# EAGLE schematic baseboard (EAGLE 9.6.2)
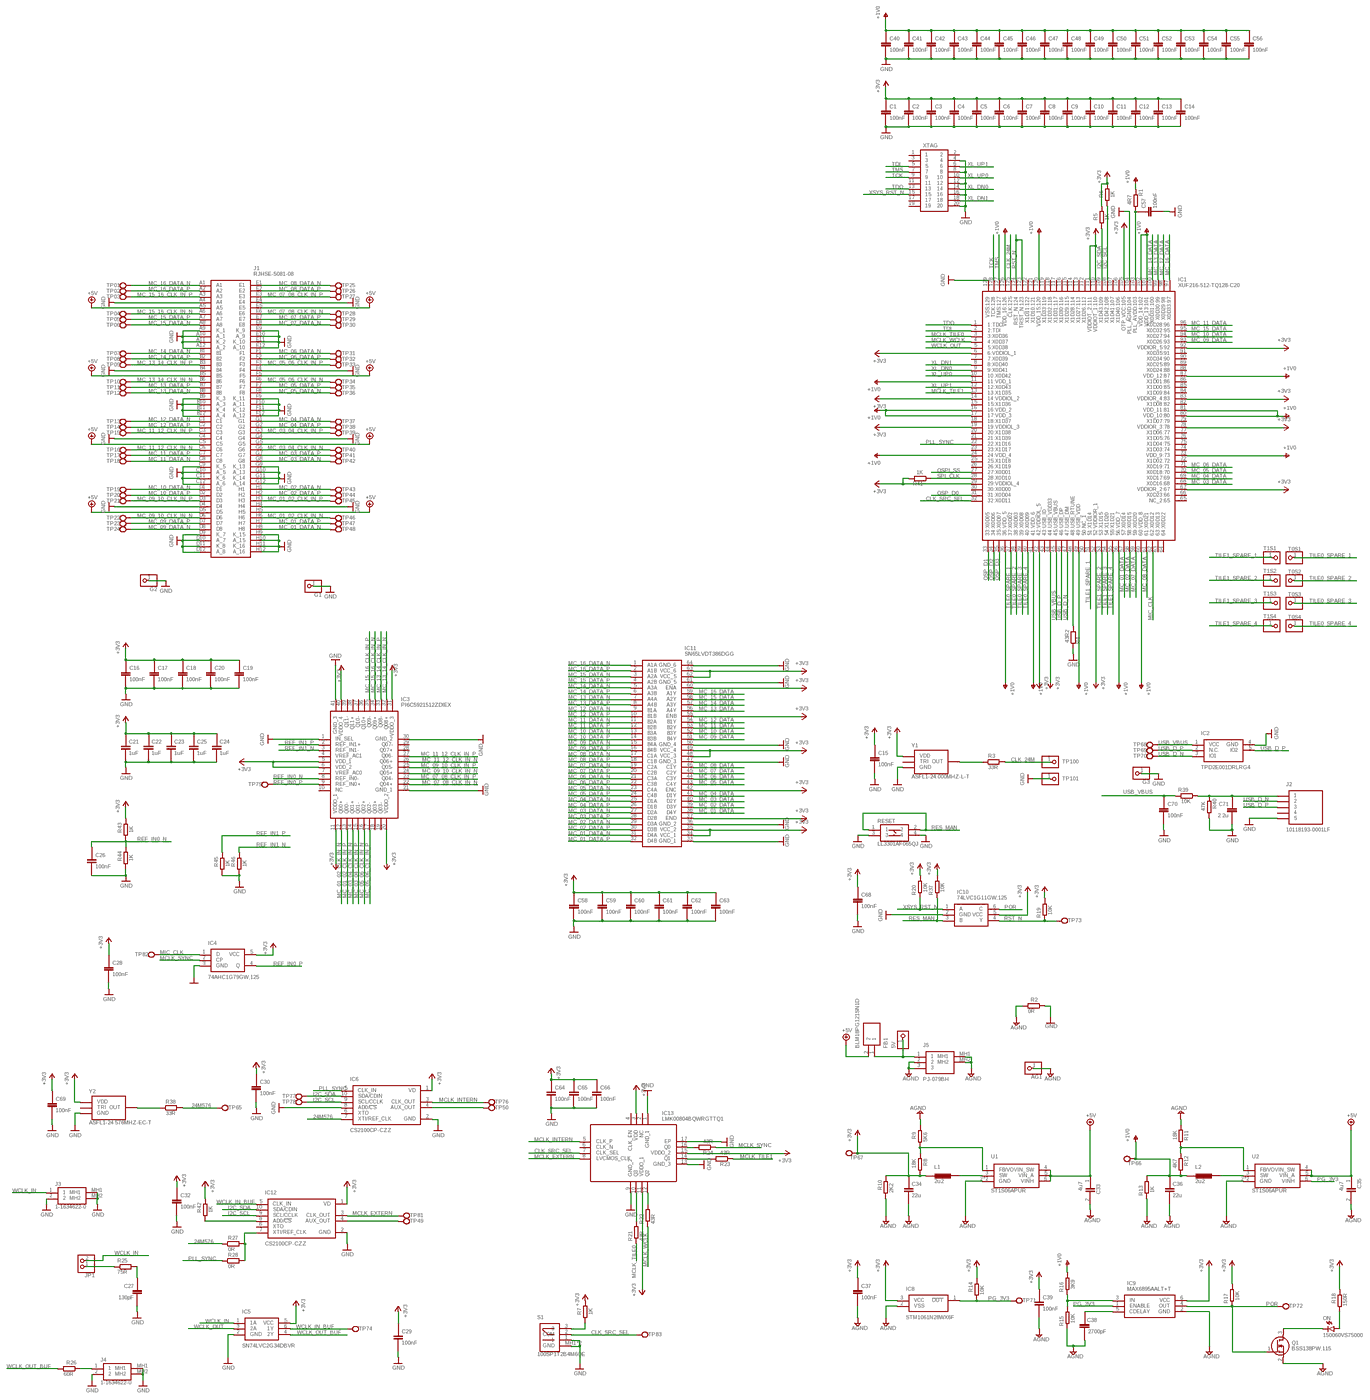
[diagram p0: schematic, sheet 1, overview]
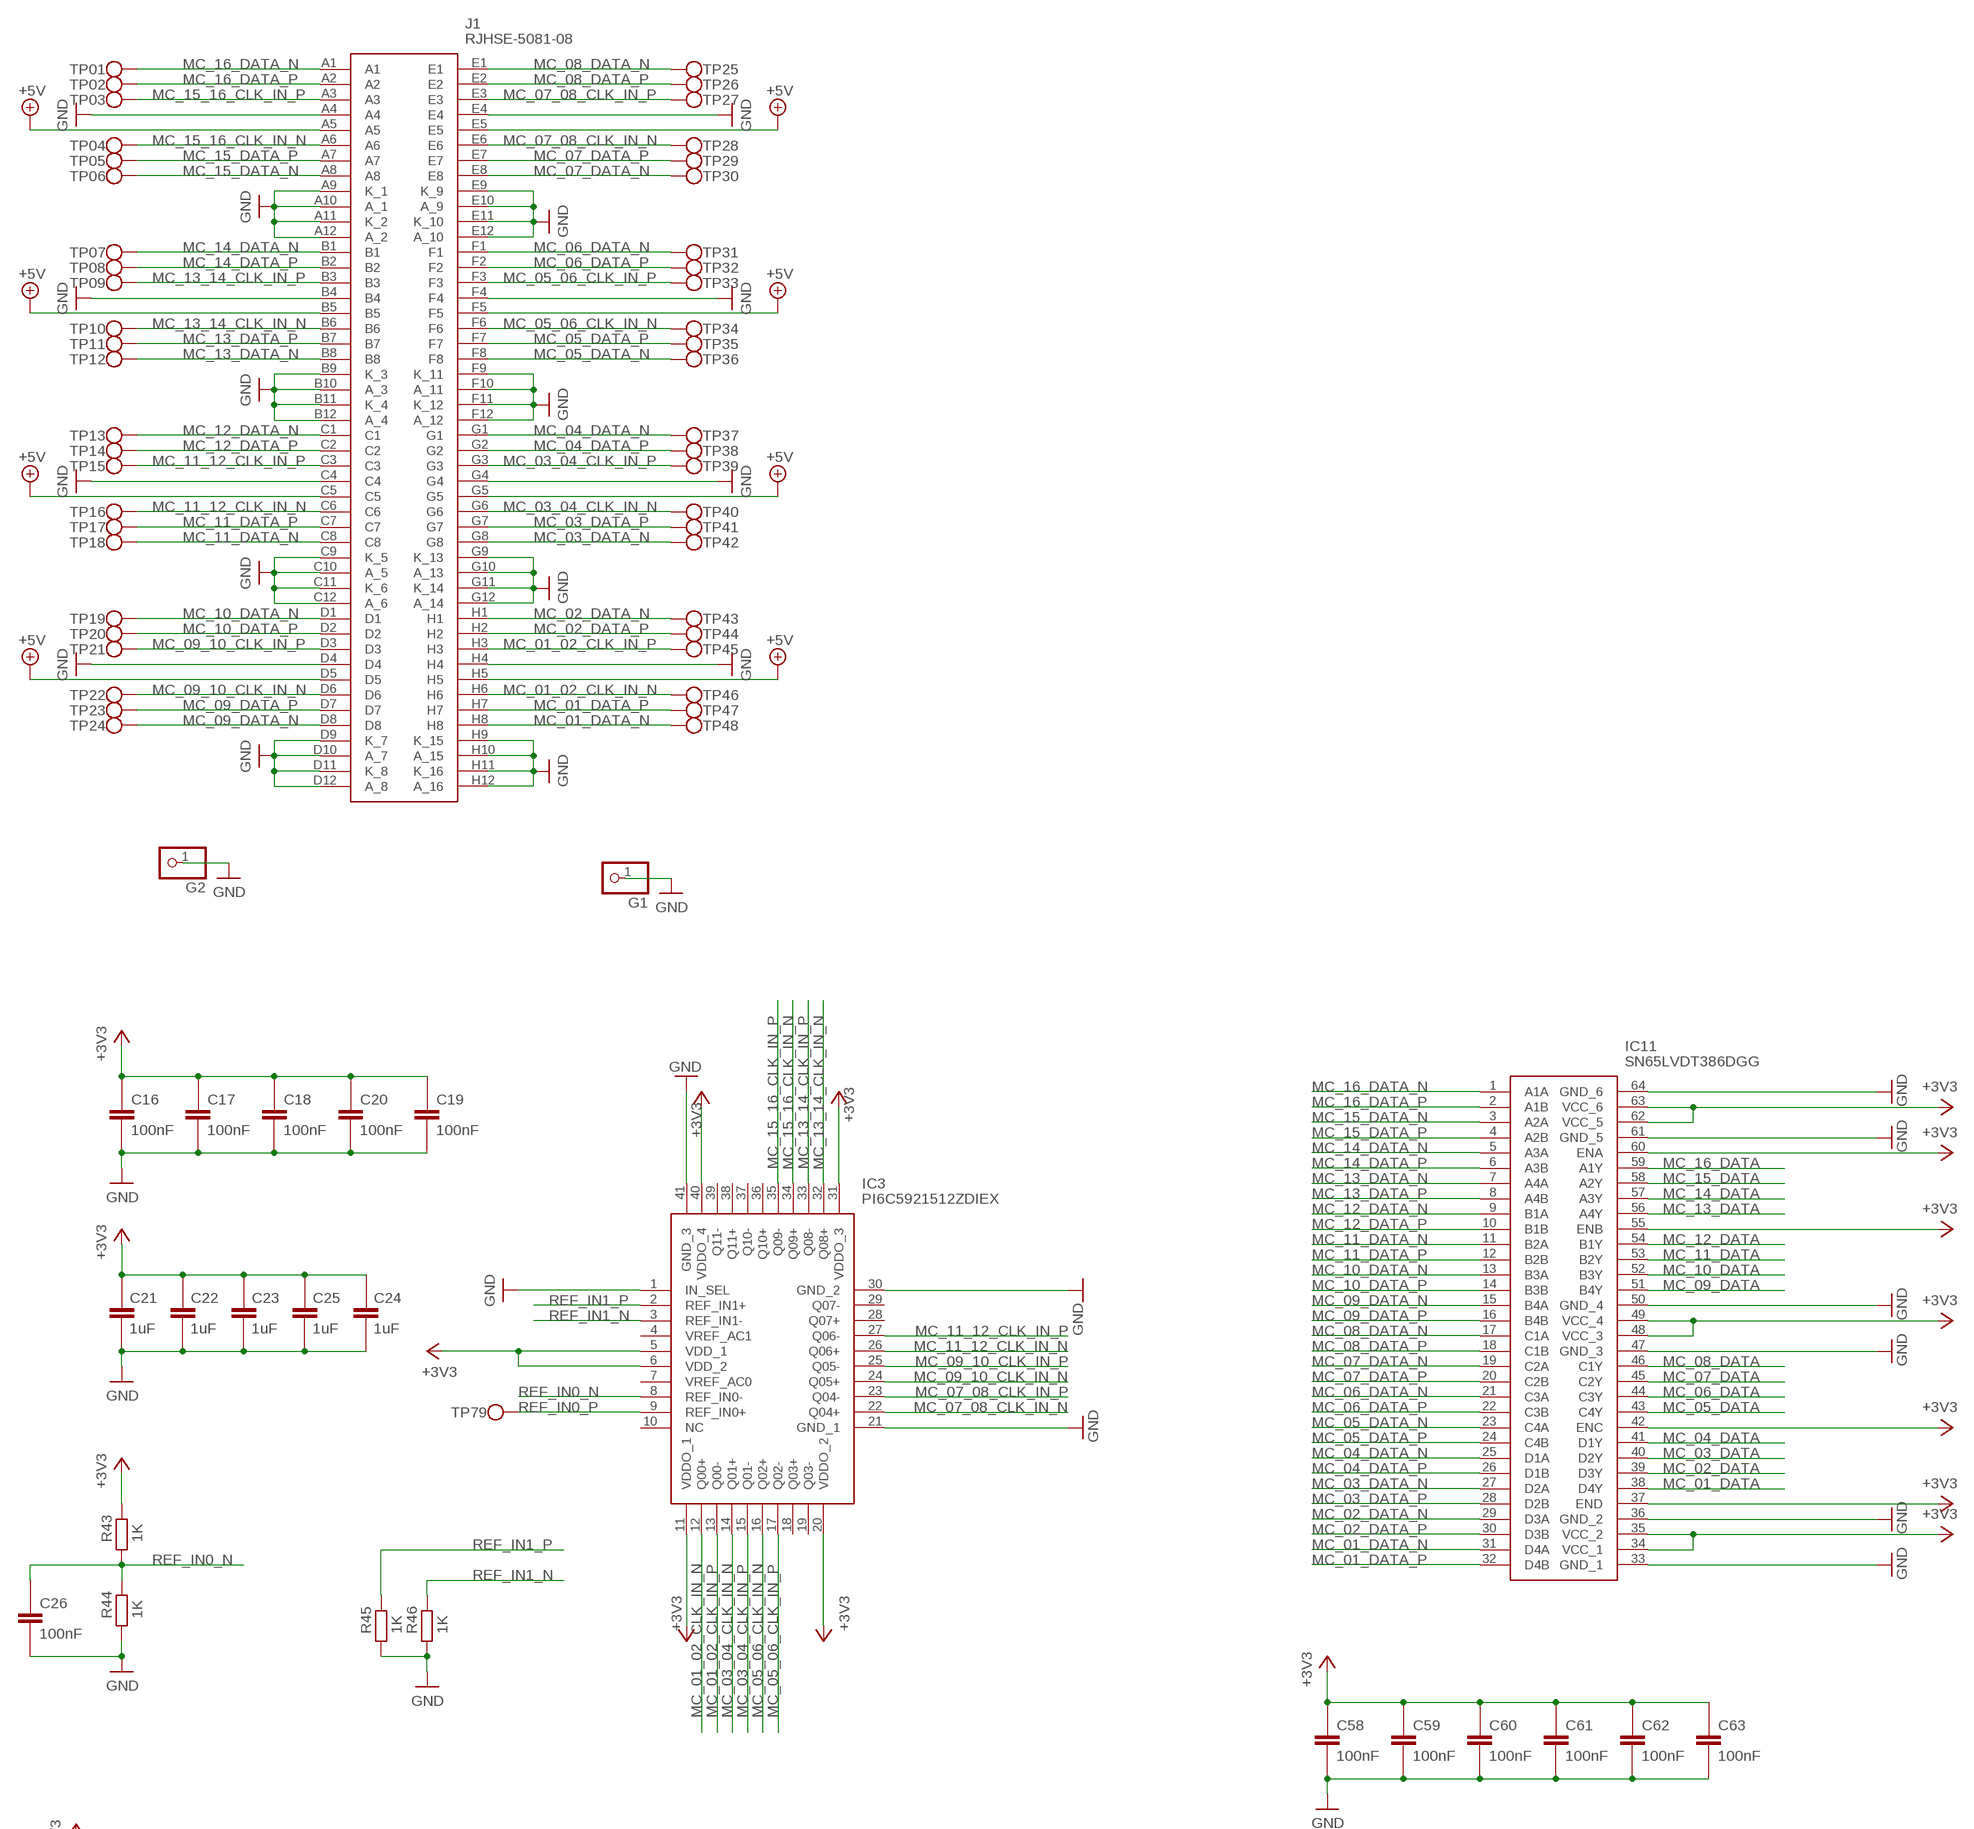
[diagram p1: schematic, sheet 1, part 1 of 4]
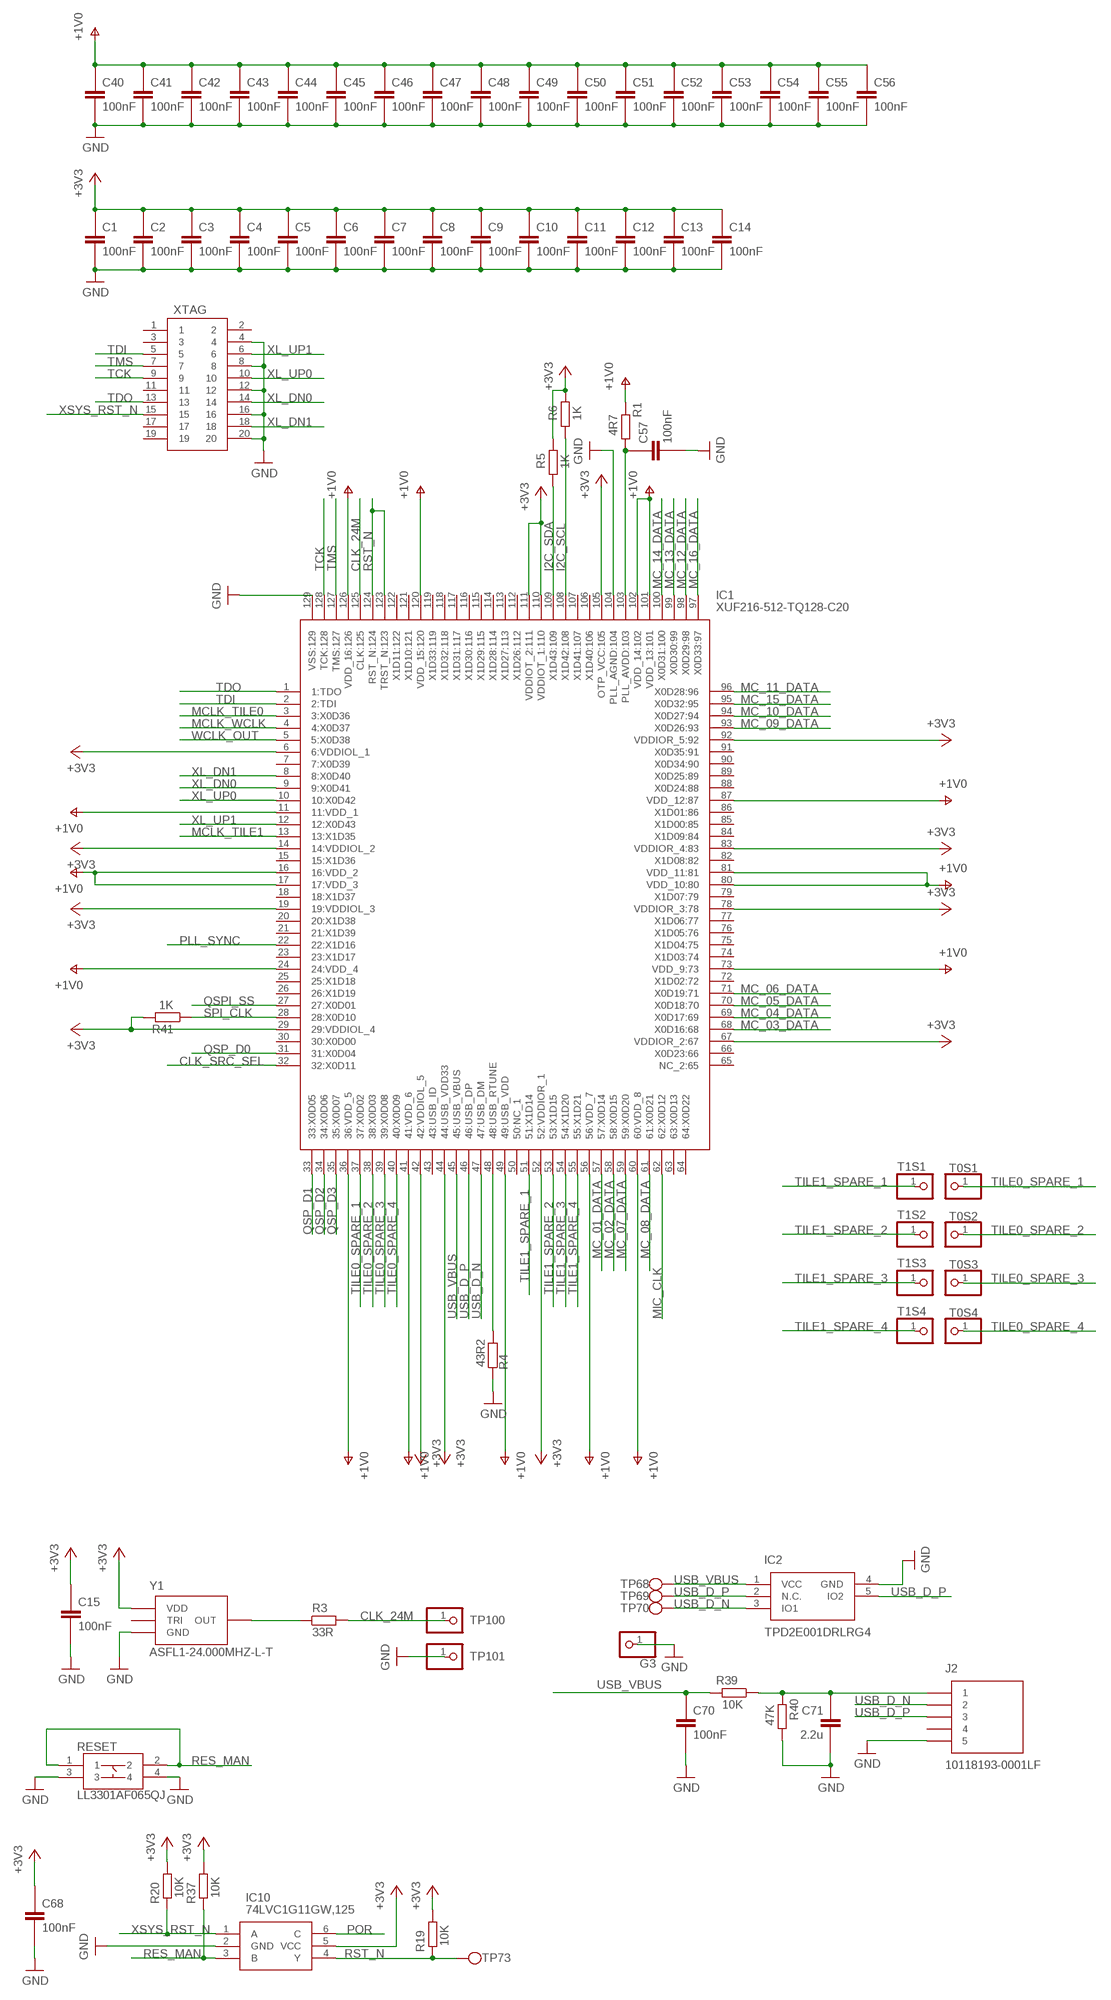
[diagram p2: schematic, sheet 1, part 2 of 4]
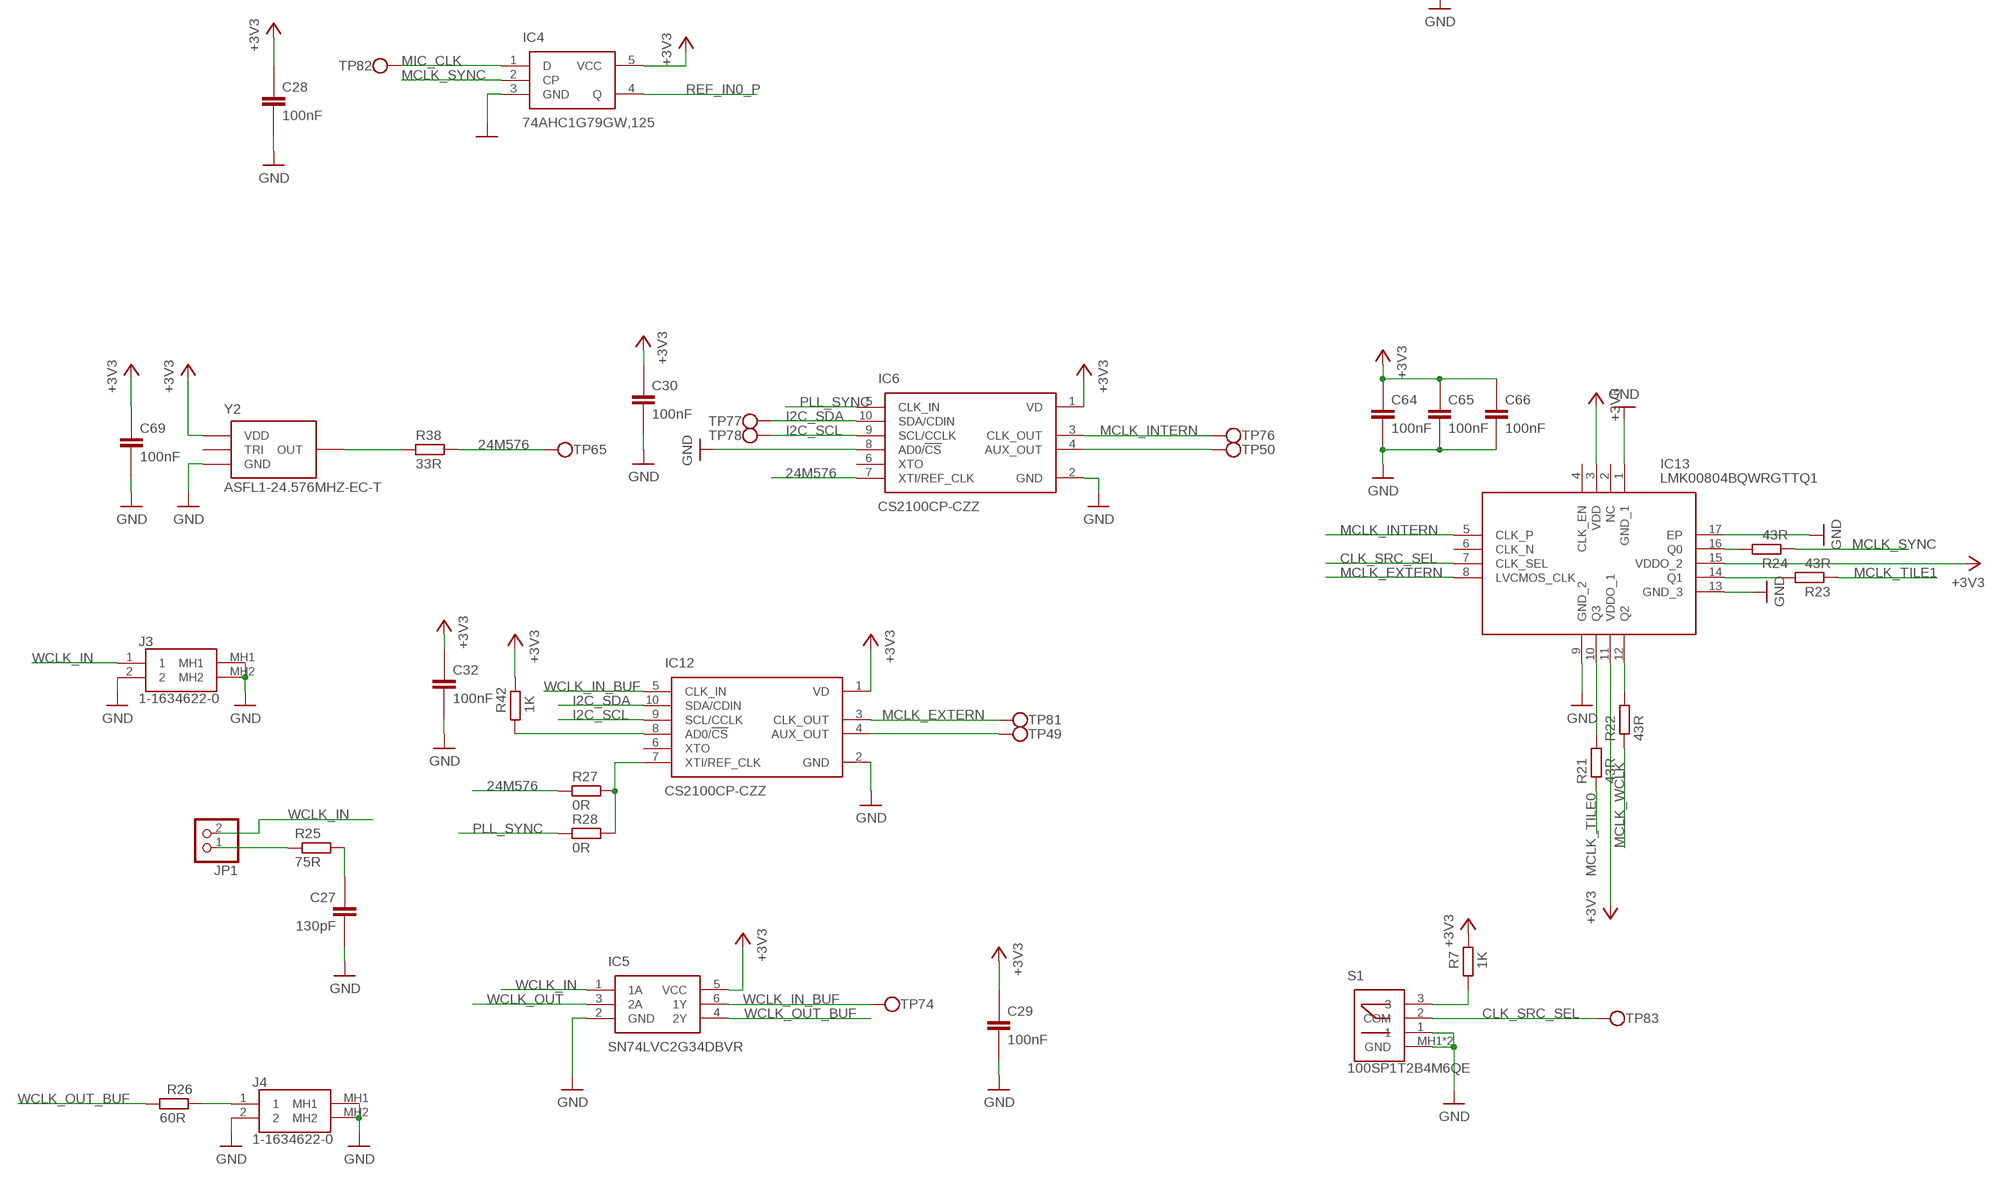
[diagram p3: schematic, sheet 1, part 3 of 4]
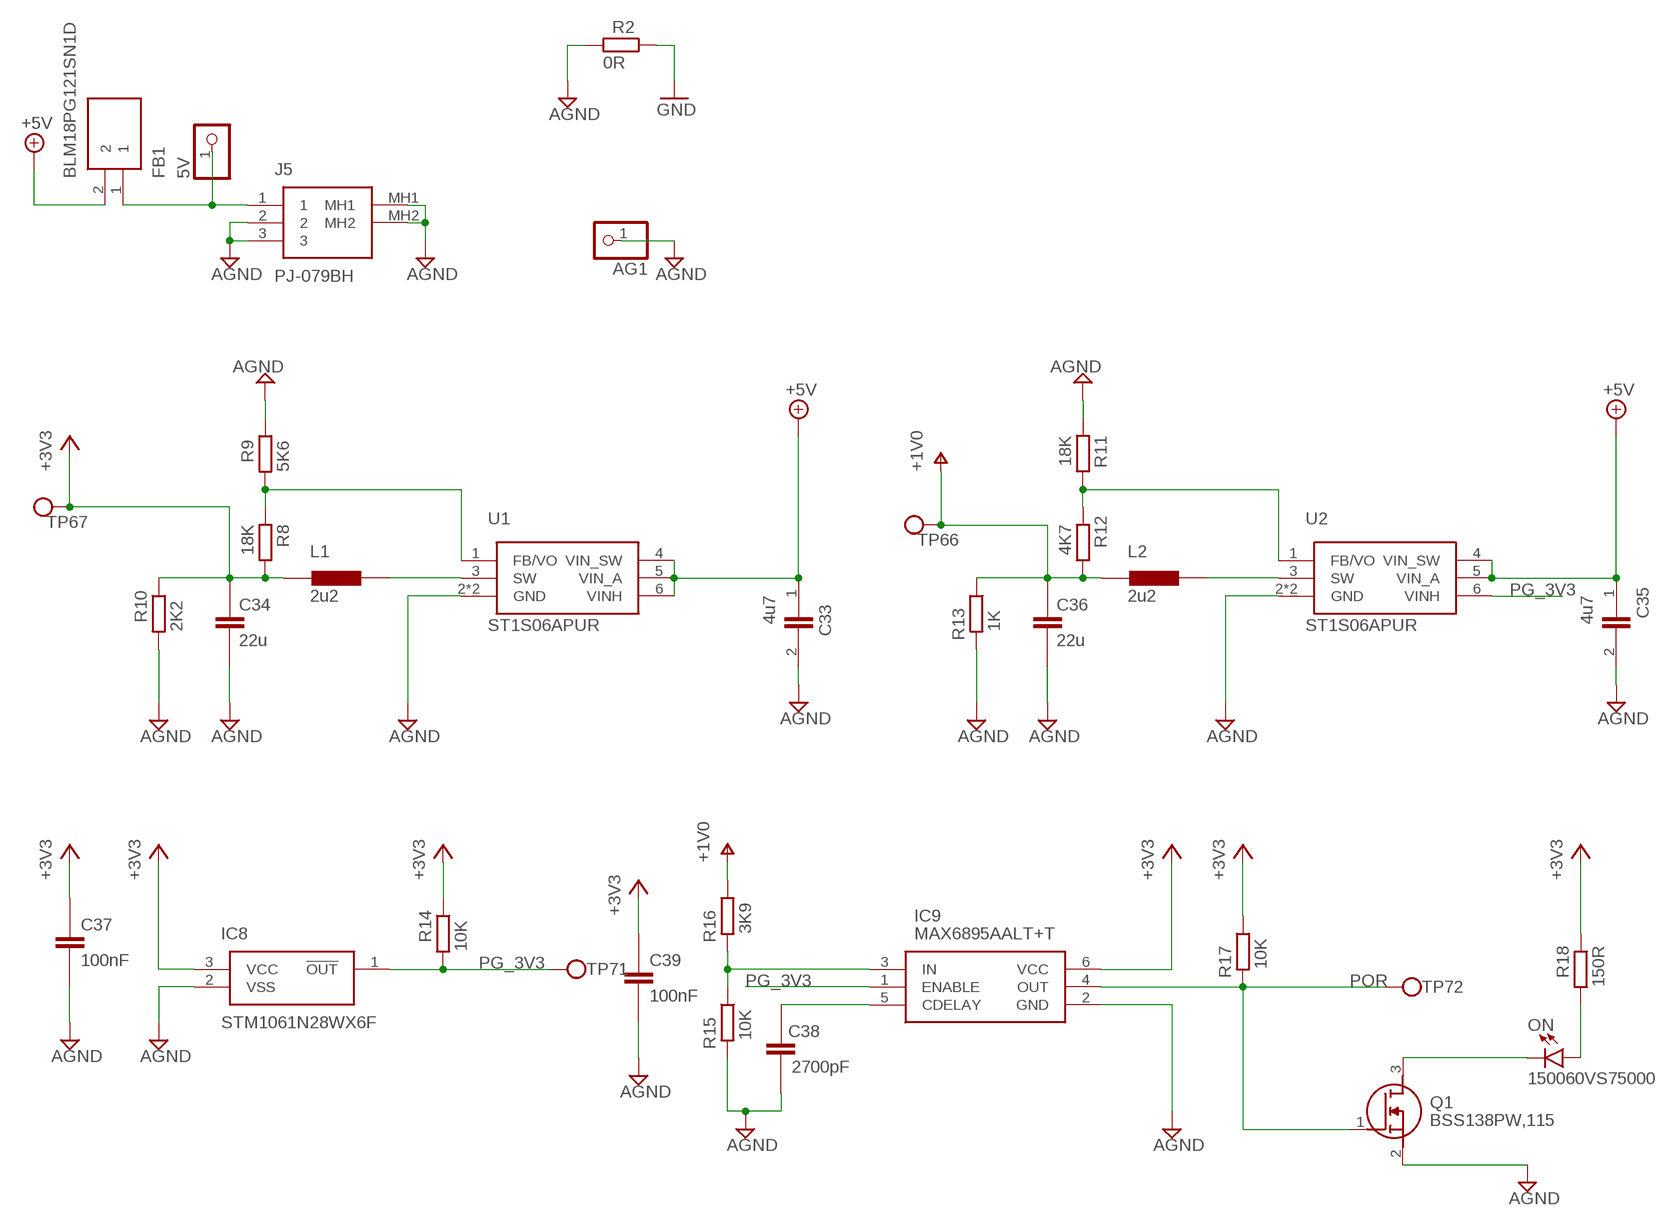
[diagram p4: schematic, sheet 1, part 4 of 4]

## Parts
5V  PINHD-1X1  [1X01]
AG1  PINHD-1X1  [1X01]
C1  100nF  885012205037  [CAPC1005X55N]
C2  100nF  885012205037  [CAPC1005X55N]
C3  100nF  885012205037  [CAPC1005X55N]
C4  100nF  885012205037  [CAPC1005X55N]
C5  100nF  885012205037  [CAPC1005X55N]
C6  100nF  885012205037  [CAPC1005X55N]
C7  100nF  885012205037  [CAPC1005X55N]
C8  100nF  885012205037  [CAPC1005X55N]
C9  100nF  885012205037  [CAPC1005X55N]
C10  100nF  885012205037  [CAPC1005X55N]
C11  100nF  885012205037  [CAPC1005X55N]
C12  100nF  885012205037  [CAPC1005X55N]
C13  100nF  885012205037  [CAPC1005X55N]
C14  100nF  885012205037  [CAPC1005X55N]
C15  100nF  885012205037  [CAPC1005X55N]
C16  100nF  885012205037  [CAPC1005X55N]
C17  100nF  885012205037  [CAPC1005X55N]
C18  100nF  885012205037  [CAPC1005X55N]
C19  100nF  885012205037  [CAPC1005X55N]
C20  100nF  885012205037  [CAPC1005X55N]
C21  1uF  EMK105BJ105KV-F  [CAPC1005X55N]
C22  1uF  EMK105BJ105KV-F  [CAPC1005X55N]
C23  1uF  EMK105BJ105KV-F  [CAPC1005X55N]
C24  1uF  EMK105BJ105KV-F  [CAPC1005X55N]
C25  1uF  EMK105BJ105KV-F  [CAPC1005X55N]
C26  100nF  885012205037  [CAPC1005X55N]
C27  130pF  0402N131J500CT  [CAPC1005X55N]
C28  100nF  885012205037  [CAPC1005X55N]
C29  100nF  885012205037  [CAPC1005X55N]
C30  100nF  885012205037  [CAPC1005X55N]
C32  100nF  885012205037  [CAPC1005X55N]
C33  4u7  GRM155R61A475MEAAD  [CAPC1005X55N]
C34  22u  GRM21BR61A226ME51L  [CAPC2012X145N]
C35  4u7  GRM155R61A475MEAAD  [CAPC1005X55N]
C36  22u  GRM21BR61A226ME51L  [CAPC2012X145N]
C37  100nF  885012205037  [CAPC1005X55N]
C38  2N2  C0402C272K5RACTU  [CAPC1005X55N]
C39  100nF  885012205037  [CAPC1005X55N]
C40  100nF  885012205037  [CAPC1005X55N]
C41  100nF  885012205037  [CAPC1005X55N]
C42  100nF  885012205037  [CAPC1005X55N]
C43  100nF  885012205037  [CAPC1005X55N]
C44  100nF  885012205037  [CAPC1005X55N]
C45  100nF  885012205037  [CAPC1005X55N]
C46  100nF  885012205037  [CAPC1005X55N]
C47  100nF  885012205037  [CAPC1005X55N]
C48  100nF  885012205037  [CAPC1005X55N]
C49  100nF  885012205037  [CAPC1005X55N]
C50  100nF  885012205037  [CAPC1005X55N]
C51  100nF  885012205037  [CAPC1005X55N]
C52  100nF  885012205037  [CAPC1005X55N]
C53  100nF  885012205037  [CAPC1005X55N]
C54  100nF  885012205037  [CAPC1005X55N]
C55  100nF  885012205037  [CAPC1005X55N]
C56  100nF  885012205037  [CAPC1005X55N]
C57  100nF  885012205037  [CAPC1005X55N]
C58  100nF  885012205037  [CAPC1005X55N]
C59  100nF  885012205037  [CAPC1005X55N]
C60  100nF  885012205037  [CAPC1005X55N]
C61  100nF  885012205037  [CAPC1005X55N]
C62  100nF  885012205037  [CAPC1005X55N]
C63  100nF  885012205037  [CAPC1005X55N]
C64  100nF  885012205037  [CAPC1005X55N]
C65  100nF  885012205037  [CAPC1005X55N]
C66  100nF  885012205037  [CAPC1005X55N]
C68  100nF  885012205037  [CAPC1005X55N]
C69  100nF  885012205037  [CAPC1005X55N]
C70  100nF  885012205037  [CAPC1005X55N]
C71  GRM188R71A225KE15D  [CAPC1608X90N]
FB1  BLM18PG121SN1D  [BEADC1608X95N]
G1  PINHD-1X1  [1X01]
G2  PINHD-1X1  [1X01]
G3  PINHD-1X1  [1X01]
IC1  XUF216-512-TQ128-C20  [QFP40P1600X1600X120-129N]
IC2  TPD2E001DRLRG4  [SOTFL50P160X60-5N]
IC3  PI6C5921512ZDIEX  [QFN50P600X600X80-41N]
IC4  74AHC1G79GW,125  [SOT65P212X110-5N]
IC5  SN74LVC2G34DBVR  [SOT95P280X145-6N]
IC6  CS2100CP-CZZ  [SOP50P490X110-10N]
IC8  STM1061N28WX6F  [SOT103P237X112-3N]
IC9  MAX6895AALT+T  [SON50P100X150X75-6N]
IC10  74LVC1G11GW,125  [SOP65P210X110-6N]
IC11  SN65LVDT386DGG  [SOP50P810X120-64N]
IC12  CS2100CP-CZZ  [SOP50P490X110-10N]
IC13  LMK00804BQWRGTTQ1  [QFN50P300X300X100-17N]
J1  RJHSE-5081-08  [RJHSE508108]
J2  10118193-0001LF  [101181930001LF]
J3  1-1634622-0  [116346220]
J4  1-1634622-0  [116346220]
J5  PJ-079BH  [PJ079BH]
JP1  PINHD-1X2  [1X02]
L1  NRH2412T2R2MNGH  [NRH2412T2R2MNGH]
L2  NRH2412T2R2MNGH  [NRH2412T2R2MNGH]
ON  150060VS75000  [LEDC1608X80N]
Q1  BSS138PW,115  [SOT65P210X110-3N]
R1  4R7  RC0402FR-074R7L  [RESC1005X40N]
R2  0R  RC1206JR-7W0RL  [RESC3116X65N]
R3  33R  ERA-2AKD330X  [RESC1005X40N]
R4  43R2  CRCW040243R2FKED  [RESC1005X40N]
R5  1K  ERJ-2RKF1001X  [RESC1005X40N]
R6  1K  ERJ-2RKF1001X  [RESC1005X40N]
R7  1K  ERJ-2RKF1001X  [RESC1005X40N]
R8  18K  ESR10EZPJ183  [RESC2012X65N]
R9  5K6  ERJP06J562V  [RESC2012X70N]
R10  2K2  CRGH0805F2K2  [RESC2013X65N]
R11  18K  ESR10EZPJ183  [RESC2012X65N]
R12  4K7  CRGH0805F4K7  [RESC2013X65N]
R13  AS08J1001ET  [RESC2013X65N]
R14  10k  ERJ2RKF1002X  [RESC1005X40N]
R15  10k  ERJ2RKF1002X  [RESC1005X40N]
R16  3K9  RC0100JR-073K9L  [RESC0402X15N]
R17  10k  ERJ2RKF1002X  [RESC1005X40N]
R18  150R  ERJ-2RKF1500X  [RESC1005X40N]
R19  10k  ERJ2RKF1002X  [RESC1005X40N]
R20  10k  ERJ2RKF1002X  [RESC1005X40N]
R21  43R  CRCW040243R0FKED  [RESC1005X40N]
R22  43R  CRCW040243R0FKED  [RESC1005X40N]
R23  43R  CRCW040243R0FKED  [RESC1005X40N]
R24  43R  CRCW040243R0FKED  [RESC1005X40N]
R25  75R  CR0402-FX-75R0GLF  [RESC1005X40N]
R26  75R  RG1005P-60R4-D-T10  [RESC1005X40N]
R27  CRCW04020000Z0EDC  [RESC1005X35N]
R28  CRCW04020000Z0EDC  [RESC1005X35N]
R37  10k  ERJ2RKF1002X  [RESC1005X40N]
R38  33R  ERA-2AKD330X  [RESC1005X40N]
R39  10k  ERJ2RKF1002X  [RESC1005X40N]
R40  CRCW040247K0FKEDC  [RESC1005X35N]
R41  1K  ERJ-2RKF1001X  [RESC1005X40N]
R42  1K  ERJ-2RKF1001X  [RESC1005X40N]
R43  1K  ERJ-2RKF1001X  [RESC1005X40N]
R44  1K  ERJ-2RKF1001X  [RESC1005X40N]
R45  1K  ERJ-2RKF1001X  [RESC1005X40N]
R46  1K  ERJ-2RKF1001X  [RESC1005X40N]
RESET  LL3301AF065QJ  [LL3301FF065QJ]
S1  100SP1T2B4M6QE  [100SP1T2B4M6QE]
T0S1  PINHD-1X1  [1X01]
T0S2  PINHD-1X1  [1X01]
T0S3  PINHD-1X1  [1X01]
T0S4  PINHD-1X1  [1X01]
T1S1  PINHD-1X1  [1X01]
T1S2  PINHD-1X1  [1X01]
T1S3  PINHD-1X1  [1X01]
T1S4  PINHD-1X1  [1X01]
TP01  TESTPOINT_05_05  [TP_05_05]
TP02  TESTPOINT_05_05  [TP_05_05]
TP03  TESTPOINT_05_05  [TP_05_05]
TP04  TESTPOINT_05_05  [TP_05_05]
TP05  TESTPOINT_05_05  [TP_05_05]
TP06  TESTPOINT_05_05  [TP_05_05]
TP07  TESTPOINT_05_05  [TP_05_05]
TP08  TESTPOINT_05_05  [TP_05_05]
TP09  TESTPOINT_05_05  [TP_05_05]
TP10  TESTPOINT_05_05  [TP_05_05]
TP11  TESTPOINT_05_05  [TP_05_05]
TP12  TESTPOINT_05_05  [TP_05_05]
TP13  TESTPOINT_05_05  [TP_05_05]
TP14  TESTPOINT_05_05  [TP_05_05]
TP15  TESTPOINT_05_05  [TP_05_05]
TP16  TESTPOINT_05_05  [TP_05_05]
TP17  TESTPOINT_05_05  [TP_05_05]
TP18  TESTPOINT_05_05  [TP_05_05]
TP19  TESTPOINT_05_05  [TP_05_05]
TP20  TESTPOINT_05_05  [TP_05_05]
TP21  TESTPOINT_05_05  [TP_05_05]
TP22  TESTPOINT_05_05  [TP_05_05]
TP23  TESTPOINT_05_05  [TP_05_05]
TP24  TESTPOINT_05_05  [TP_05_05]
TP25  TESTPOINT_05_05  [TP_05_05]
TP26  TESTPOINT_05_05  [TP_05_05]
TP27  TESTPOINT_05_05  [TP_05_05]
TP28  TESTPOINT_05_05  [TP_05_05]
TP29  TESTPOINT_05_05  [TP_05_05]
TP30  TESTPOINT_05_05  [TP_05_05]
TP31  TESTPOINT_05_05  [TP_05_05]
TP32  TESTPOINT_05_05  [TP_05_05]
TP33  TESTPOINT_05_05  [TP_05_05]
TP34  TESTPOINT_05_05  [TP_05_05]
TP35  TESTPOINT_05_05  [TP_05_05]
TP36  TESTPOINT_05_05  [TP_05_05]
TP37  TESTPOINT_05_05  [TP_05_05]
TP38  TESTPOINT_05_05  [TP_05_05]
TP39  TESTPOINT_05_05  [TP_05_05]
TP40  TESTPOINT_05_05  [TP_05_05]
TP41  TESTPOINT_05_05  [TP_05_05]
TP42  TESTPOINT_05_05  [TP_05_05]
TP43  TESTPOINT_05_05  [TP_05_05]
TP44  TESTPOINT_05_05  [TP_05_05]
TP45  TESTPOINT_05_05  [TP_05_05]
TP46  TESTPOINT_05_05  [TP_05_05]
TP47  TESTPOINT_05_05  [TP_05_05]
TP48  TESTPOINT_05_05  [TP_05_05]
TP49  TESTPOINT_05_05  [TP_05_05]
TP50  TESTPOINT_05_05  [TP_05_05]
TP65  TESTPOINT_05_05  [TP_05_05]
TP66  TESTPOINT_05_05  [TP_05_05]
TP67  TESTPOINT_05_05  [TP_05_05]
TP68  TESTPOINT_05_05  [TP_05_05]
TP69  TESTPOINT_05_05  [TP_05_05]
TP70  TESTPOINT_05_05  [TP_05_05]
TP71  TESTPOINT_05_05  [TP_05_05]
TP72  TESTPOINT_05_05  [TP_05_05]
TP73  TESTPOINT_05_05  [TP_05_05]
TP74  TESTPOINT_05_05  [TP_05_05]
TP76  TESTPOINT_05_05  [TP_05_05]
TP77  TESTPOINT_05_05  [TP_05_05]
TP78  TESTPOINT_05_05  [TP_05_05]
TP79  TESTPOINT_05_05  [TP_05_05]
TP81  TESTPOINT_05_05  [TP_05_05]
TP82  TESTPOINT_05_05  [TP_05_05]
TP83  TESTPOINT_05_05  [TP_05_05]
TP100  PINHD-1X1  [1X01]
TP101  PINHD-1X1  [1X01]
U1  ST1S06APUR  [DFN6D]
U2  ST1S06APUR  [DFN6D]
XTAG  30320-5002HB  [303205002HB]
Y1  ASFL1-24.000MHZ-L-T  [ASFL-1]
Y2  ASFL1-24.576MHZ-EC-T  [ASFL-1]

## Nets
24M576: IC6.7(XTI/REF_CLK) R27.1 R38.2 TP65.TP
+3V3: C1.2 C2.2 C3.2 C4.2 C5.2 C6.2 C7.2 C8.2 C9.2 C10.2 C11.2 C12.2 C13.2 C14.2 C15.2 C16.2 C17.2 C18.2 C19.2 C20.2 C21.2 C22.2 C23.2 C24.2 C25.2 C28.2 C29.2 C30.2 C32.2 C34.2 C37.2 C39.2 C58.2 C59.2 C60.2 C61.2 C62.2 C63.2 C64.2 C65.2 C66.2 C68.2 C69.2 IC1.6(6:VDDIOL_1) IC1.14(14:VDDIOL_2) IC1.19(19:VDDIOL_3) IC1.29(29:VDDIOL_4) IC1.42(42:VDDIOL_5) IC1.44(44:USB_VDD33) IC1.52(52:VDDIOR_1) IC1.67(VDDIOR_2:67) IC1.78(VDDIOR_3:78) IC1.83(VDDIOR_4:83) IC1.92(VDDIOR_5:92) IC1.105(OTP_VCC:105) IC1.110(VDDIOT_1:110) IC1.111(VDDIOT_2:111) IC3.5(VDD_1) IC3.6(VDD_2) IC3.11(VDDO_1) IC3.20(VDDO_2) IC3.31(VDDO_3) IC3.40(VDDO_4) IC4.5(VCC) IC5.5(VCC) IC6.1(VD) IC8.3(VCC) IC9.6(VCC) IC10.5(VCC) IC11.34(VCC_1) IC11.35(VCC_2) IC11.37(END) IC11.42(ENC) IC11.48(VCC_3) IC11.49(VCC_4) IC11.55(ENB) IC11.60(ENA) IC11.62(VCC_5) IC11.63(VCC_6) IC12.1(VD) IC13.3(VDD) IC13.11(VDDO_1) IC13.15(VDDO_2) L1.1 R5.2 R6.2 R7.2 R8.2 R10.2 R14.2 R17.2 R18.2 R19.2 R20.2 R37.2 R41.2 R42.2 R43.2 TP67.TP Y1.VDD Y2.VDD
+5V: C33.1 C35.1 FB1.2 J1.A5 J1.B5 J1.C5 J1.D5 J1.E5 J1.F5 J1.G5 J1.H5 U1.4(VIN_SW) U1.5(VIN_A) U1.6(VINH) U2.4(VIN_SW) U2.5(VIN_A)
AGND: AG1.1 C33.2 C34.1 C35.2 C36.1 C37.1 C38.2 C39.1 IC8.2(VSS) IC9.2(GND) J5.2 J5.3 J5.MH1 J5.MH2 Q1.2(S) R2.1 R9.2 R10.1 R11.1 R13.1 R15.1 U1.2(GND) U1.GND U2.2(GND) U2.GND
CLK_24M: IC1.125(CLK:125) R3.2 TP100.1
CLK_SRC_SEL: IC1.32(32:X0D11) IC13.7(CLK_SEL) S1.2(COM) TP83.TP
GND: C1.1 C2.1 C3.1 C4.1 C5.1 C6.1 C7.1 C8.1 C9.1 C10.1 C11.1 C12.1 C13.1 C14.1 C15.1 C16.1 C17.1 C18.1 C19.1 C20.1 C21.1 C22.1 C23.1 C24.1 C25.1 C26.1 C27.2 C28.1 C29.1 C30.1 C32.1 C40.1 C41.1 C42.1 C43.1 C44.1 C45.1 C46.1 C47.1 C48.1 C49.1 C50.1 C51.1 C52.1 C53.1 C54.1 C55.1 C56.1 C57.1 C58.1 C59.1 C60.1 C61.1 C62.1 C63.1 C64.1 C65.1 C66.1 C68.1 C69.1 C70.1 C71.2 G1.1 G2.1 G3.1 IC1.104(PLL_AGND:104) IC1.129(VSS:129) IC2.4(GND) IC3.1(IN_SEL) IC3.21(GND_1) IC3.30(GND_2) IC3.41(GND_3) IC4.3(GND) IC5.2(GND) IC6.2(GND) IC6.8(AD0/!CS) IC10.2(GND) IC11.33(GND_1) IC11.36(GND_2) IC11.47(GND_3) IC11.50(GND_4) IC11.61(GND_5) IC11.64(GND_6) IC12.2(GND) IC13.1(GND_1) IC13.9(GND_2) IC13.13(GND_3) IC13.17(EP) J1.A4 J1.A9(K_1) J1.A10(A_1) J1.A11(K_2) J1.A12(A_2) J1.B4 J1.B9(K_3) J1.B10(A_3) J1.B11(K_4) J1.B12(A_4) J1.C4 J1.C9(K_5) J1.C10(A_5) J1.C11(K_6) J1.C12(A_6) J1.D4 J1.D9(K_7) J1.D10(A_7) J1.D11(K_8) J1.D12(A_8) J1.E4 J1.E9(K_9) J1.E10(A_9) J1.E11(K_10) J1.E12(A_10) J1.F4 J1.F9(K_11) J1.F10(A_11) J1.F11(K_12) J1.F12(A_12) J1.G4 J1.G9(K_13) J1.G10(A_13) J1.G11(K_14) J1.G12(A_14) J1.H4 J1.H9(K_15) J1.H10(A_15) J1.H11(K_16) J1.H12(A_16) J2.5 J2.MH1 J2.MH2 J2.MP1 J2.MP2 J2.MP3 J2.MP4 J3.2 J3.MH1 J3.MH2 J4.2 J4.MH1 J4.MH2 R2.2 R4.1 R40.2 R44.1 R45.1 R46.1 RESET.3 RESET.4 S1.1 S1.MH1(GND) S1.MH2(GND) TP101.1 XTAG.4 XTAG.8 XTAG.12 XTAG.16 XTAG.20 Y1.GND Y2.GND
I2C_SCL: IC1.108(X1D42:108) IC6.9(SCL/CCLK) IC12.9(SCL/CCLK) R6.1 TP78.TP
I2C_SDA: IC1.109(X1D43:109) IC6.10(SDA/CDIN) IC12.10(SDA/CDIN) R5.1 TP77.TP
MC_01_02_CLK_IN_N [diff_pair_top]: IC3.12(Q00+) J1.H6 TP46.TP
MC_01_02_CLK_IN_P [diff_pair_top]: IC3.13(Q00-) J1.H3 TP45.TP
MC_01_DATA: IC1.57(57:X0D14) IC11.38(D4Y)
MC_01_DATA_N [diff_pair_bot]: IC11.31(D4A) J1.H8 TP48.TP
MC_01_DATA_P [diff_pair_bot]: IC11.32(D4B) J1.H7 TP47.TP
MC_02_DATA: IC1.58(58:X0D15) IC11.39(D3Y)
MC_02_DATA_N [diff_pair_bot]: IC11.29(D3A) J1.H1 TP43.TP
MC_02_DATA_P [diff_pair_bot]: IC11.30(D3B) J1.H2 TP44.TP
MC_03_04_CLK_IN_N [diff_pair_top]: IC3.14(Q01+) J1.G6 TP40.TP
MC_03_04_CLK_IN_P [diff_pair_top]: IC3.15(Q01-) J1.G3 TP39.TP
MC_03_DATA: IC1.68(X0D16:68) IC11.40(D2Y)
MC_03_DATA_N [diff_pair_bot]: IC11.27(D2A) J1.G8 TP42.TP
MC_03_DATA_P [diff_pair_bot]: IC11.28(D2B) J1.G7 TP41.TP
MC_04_DATA: IC1.69(X0D17:69) IC11.41(D1Y)
MC_04_DATA_N [diff_pair_bot]: IC11.25(D1A) J1.G1 TP37.TP
MC_04_DATA_P [diff_pair_bot]: IC11.26(D1B) J1.G2 TP38.TP
MC_05_06_CLK_IN_N [diff_pair_top]: IC3.16(Q02+) J1.F6 TP34.TP
MC_05_06_CLK_IN_P [diff_pair_top]: IC3.17(Q02-) J1.F3 TP33.TP
MC_05_DATA: IC1.70(X0D18:70) IC11.43(C4Y)
MC_05_DATA_N [diff_pair_bot]: IC11.23(C4A) J1.F8 TP36.TP
MC_05_DATA_P [diff_pair_bot]: IC11.24(C4B) J1.F7 TP35.TP
MC_06_DATA: IC1.71(X0D19:71) IC11.44(C3Y)
MC_06_DATA_N [diff_pair_bot]: IC11.21(C3A) J1.F1 TP31.TP
MC_06_DATA_P [diff_pair_bot]: IC11.22(C3B) J1.F2 TP32.TP
MC_07_08_CLK_IN_N [diff_pair_top]: IC3.22(Q04+) J1.E6 TP28.TP
MC_07_08_CLK_IN_P [diff_pair_top]: IC3.23(Q04-) J1.E3 TP27.TP
MC_07_DATA: IC1.59(59:X0D20) IC11.45(C2Y)
MC_07_DATA_N [diff_pair_bot]: IC11.19(C2A) J1.E8 TP30.TP
MC_07_DATA_P [diff_pair_bot]: IC11.20(C2B) J1.E7 TP29.TP
MC_08_DATA: IC1.61(61:X0D21) IC11.46(C1Y)
MC_08_DATA_N [diff_pair_bot]: IC11.17(C1A) J1.E1 TP25.TP
MC_08_DATA_P [diff_pair_bot]: IC11.18(C1B) J1.E2 TP26.TP
MC_09_10_CLK_IN_N [diff_pair_top]: IC3.24(Q05+) J1.D6 TP22.TP
MC_09_10_CLK_IN_P [diff_pair_top]: IC3.25(Q05-) J1.D3 TP21.TP
MC_09_DATA: IC1.93(X0D26:93) IC11.51(B4Y)
MC_09_DATA_N [diff_pair_bot]: IC11.15(B4A) J1.D8 TP24.TP
MC_09_DATA_P [diff_pair_bot]: IC11.16(B4B) J1.D7 TP23.TP
MC_10_DATA: IC1.94(X0D27:94) IC11.52(B3Y)
MC_10_DATA_N [diff_pair_bot]: IC11.13(B3A) J1.D1 TP19.TP
MC_10_DATA_P [diff_pair_bot]: IC11.14(B3B) J1.D2 TP20.TP
MC_11_12_CLK_IN_N [diff_pair_top]: IC3.26(Q06+) J1.C6 TP16.TP
MC_11_12_CLK_IN_P [diff_pair_top]: IC3.27(Q06-) J1.C3 TP15.TP
MC_11_DATA: IC1.96(X0D28:96) IC11.53(B2Y)
MC_11_DATA_N [diff_pair_bot]: IC11.11(B2A) J1.C8 TP18.TP
MC_11_DATA_P [diff_pair_bot]: IC11.12(B2B) J1.C7 TP17.TP
MC_12_DATA: IC1.98(X0D29:98) IC11.54(B1Y)
MC_12_DATA_N [diff_pair_bot]: IC11.9(B1A) J1.C1 TP13.TP
MC_12_DATA_P [diff_pair_bot]: IC11.10(B1B) J1.C2 TP14.TP
MC_13_14_CLK_IN_N [diff_pair_top]: IC3.32(Q08+) J1.B6 TP10.TP
MC_13_14_CLK_IN_P [diff_pair_top]: IC3.33(Q08-) J1.B3 TP09.TP
MC_13_DATA: IC1.99(X0D30:99) IC11.56(A4Y)
MC_13_DATA_N [diff_pair_bot]: IC11.7(A4A) J1.B8 TP12.TP
MC_13_DATA_P [diff_pair_bot]: IC11.8(A4B) J1.B7 TP11.TP
MC_14_DATA: IC1.100(X0D31:100) IC11.57(A3Y)
MC_14_DATA_N [diff_pair_bot]: IC11.5(A3A) J1.B1 TP07.TP
MC_14_DATA_P [diff_pair_bot]: IC11.6(A3B) J1.B2 TP08.TP
MC_15_16_CLK_IN_N [diff_pair_top]: IC3.34(Q09+) J1.A6 TP04.TP
MC_15_16_CLK_IN_P [diff_pair_top]: IC3.35(Q09-) J1.A3 TP03.TP
MC_15_DATA: IC1.95(X0D32:95) IC11.58(A2Y)
MC_15_DATA_N [diff_pair_bot]: IC11.3(A2A) J1.A8 TP06.TP
MC_15_DATA_P [diff_pair_bot]: IC11.4(A2B) J1.A7 TP05.TP
MC_16_DATA: IC1.97(X0D33:97) IC11.59(A1Y)
MC_16_DATA_N [diff_pair_bot]: IC11.1(A1A) J1.A1 TP01.TP
MC_16_DATA_P [diff_pair_bot]: IC11.2(A1B) J1.A2 TP02.TP
MCLK_EXTERN: IC12.3(CLK_OUT) IC13.8(LVCMOS_CLK) TP81.TP
MCLK_INTERN: IC6.3(CLK_OUT) IC13.5(CLK_P) TP76.TP
MCLK_SYNC: IC4.2(CP) R24.1
MCLK_TILE0: IC1.3(3:X0D36) R21.1
MCLK_TILE1: IC1.13(13:X1D35) R23.1
MCLK_WCLK: IC1.4(4:X0D37) R22.1
MIC_CLK: IC1.62(62:X0D12) IC4.1(D) TP82.TP
N$1: IC1.48(48:USB_RTUNE) R4.2
N$2: R38.1 Y2.OUT
N$3: R3.1 Y1.OUT
N$4: C57.2 IC1.103(PLL_AVDD:103) R1.2
N$5: R7.1 S1.3
N$6: C27.1 R25.2
N$7: L1.2 U1.3(SW)
N$8: R8.1 R9.1 U1.1(FB/VO)
N$9: L2.2 U2.3(SW)
N$10: IC9.3(IN) R15.2 R16.1
N$11: ON.2(A) R18.1
N$12: R11.2 R12.1 U2.1(FB/VO)
N$13: C38.1 IC9.5(CDELAY)
N$14: ON.1(K) Q1.3(D)
N$19: 5V.1 FB1.1 J5.1
N$20: C71.1 J2.1 R39.2 R40.1
N$21: IC12.8(AD0/!CS) R42.1
N$22: IC12.4(AUX_OUT) TP49.TP
N$23: JP1.1 R25.1
N$24: IC6.4(AUX_OUT) TP50.TP
N$25: IC12.7(XTI/REF_CLK) R27.2 R28.2
N$1000: IC13.16(Q0) R24.2
N$1001: IC13.14(Q1) R23.2
N$1003: IC13.12(Q2) R22.2
N$1004: IC13.10(Q3) R21.2
N$2390: J4.1 R26.2
PG_3V3: IC8.1(!OUT) IC9.1(ENABLE) R14.1 TP71.TP U2.6(VINH)
PLL_SYNC: IC1.22(22:X1D16) IC6.5(CLK_IN) R28.1
POR: IC9.4(OUT) IC10.6(C) Q1.1(G) R17.1 TP72.TP
QSP_D0: IC1.31(31:X0D04)
QSP_D1: IC1.33(33:X0D05)
QSP_D2: IC1.34(34:X0D06)
QSP_D3: IC1.35(35:X0D07)
QSPI_SS: IC1.27(27:X0D01)
REF_IN0_N: C26.2 IC3.8(REF_IN0-) R43.1 R44.2
REF_IN0_P: IC3.9(REF_IN0+) IC4.4(Q) TP79.TP
REF_IN1_N: IC3.3(REF_IN1-) R46.2
REF_IN1_P: IC3.2(REF_IN1+) R45.2
RES_MAN: IC10.3(B) R37.1 RESET.1 RESET.2
RST_N: IC1.123(TRST_N:123) IC1.124(RST_N:124) IC10.4(Y) R19.1 TP73.TP
SPI_CLK: IC1.28(28:X0D10) R41.1
TCK: IC1.128(TCK:128) XTAG.9
TDI: IC1.2(2:TDI) XTAG.5
TDO: IC1.1(1:TDO) XTAG.13
TILE0_SPARE_1: IC1.37(37:X0D02) T0S1.1
TILE0_SPARE_2: IC1.38(38:X0D03) T0S2.1
TILE0_SPARE_3: IC1.39(39:X0D08) T0S3.1
TILE0_SPARE_4: IC1.40(40:X0D09) T0S4.1
TILE1_SPARE_1: IC1.51(51:X1D14) T1S1.1
TILE1_SPARE_2: IC1.53(53:X1D15) T1S2.1
TILE1_SPARE_3: IC1.54(54:X1D20) T1S3.1
TILE1_SPARE_4: IC1.55(55:X1D21) T1S4.1
TMS: IC1.127(TMS:127) XTAG.7
USB_D_N: IC1.47(47:USB_DM) IC2.3(IO1) J2.2 TP70.TP
USB_D_P: IC1.46(46:USB_DP) IC2.2(N.C.) IC2.5(IO2) J2.3 TP69.TP
USB_VBUS: C70.2 IC1.45(45:USB_VBUS) IC2.1(VCC) R39.1 TP68.TP
V+: C36.2 C40.2 C41.2 C42.2 C43.2 C44.2 C45.2 C46.2 C47.2 C48.2 C49.2 C50.2 C51.2 C52.2 C53.2 C54.2 C55.2 C56.2 IC1.11(11:VDD_1) IC1.16(16:VDD_2) IC1.17(17:VDD_3) IC1.24(24:VDD_4) IC1.36(36:VDD_5) IC1.41(41:VDD_6) IC1.49(49:USB_VDD) IC1.56(56:VDD_7) IC1.60(60:VDD_8) IC1.73(VDD_9:73) IC1.80(VDD_10:80) IC1.81(VDD_11:81) IC1.87(VDD_12:87) IC1.101(VDD_13:101) IC1.102(VDD_14:102) IC1.120(VDD_15:120) IC1.126(VDD_16:126) L2.1 R1.1 R12.2 R13.2 R16.2 TP66.TP ; supply symbol labelled +1V0
WCLK_IN: IC5.1(1A) J3.1 JP1.2
WCLK_IN_BUF: IC5.6(1Y) IC12.5(CLK_IN) TP74.TP
WCLK_OUT: IC1.5(5:X0D38) IC5.3(2A)
WCLK_OUT_BUF: IC5.4(2Y) R26.1
XL_DN0: IC1.9(9:X0D41) XTAG.14
XL_DN1: IC1.8(8:X0D40) XTAG.18
XL_UP0: IC1.10(10:X0D42) XTAG.10
XL_UP1: IC1.12(12:X0D43) XTAG.6
XSYS_RST_N: IC10.1(A) R20.1 XTAG.15
Unconnected: IC1.7(7:X0D39) IC1.15(15:X1D36) IC1.18(18:X1D37) IC1.20(20:X1D38) IC1.21(21:X1D39) IC1.23(23:X1D17) IC1.25(25:X1D18) IC1.26(26:X1D19) IC1.30(30:X0D00) IC1.43(43:USB_ID) IC1.50(50:NC_1) IC1.63(63:X0D13) IC1.64(64:X0D22) IC1.65(NC_2:65) IC1.66(X0D23:66) IC1.72(X1D02:72) IC1.74(X1D03:74) IC1.75(X1D04:75) IC1.76(X1D05:76) IC1.77(X1D06:77) IC1.79(X1D07:79) IC1.82(X1D08:82) IC1.84(X1D09:84) IC1.85(X1D00:85) IC1.86(X1D01:86) IC1.88(X0D24:88) IC1.89(X0D25:89) IC1.90(X0D34:90) IC1.91(X0D35:91) IC1.106(X1D40:106) IC1.107(X1D41:107) IC1.112(X1D26:112) IC1.113(X1D27:113) IC1.114(X1D28:114) IC1.115(X1D29:115) IC1.116(X1D30:116) IC1.117(X1D31:117) IC1.118(X1D32:118) IC1.119(X1D33:119) IC1.121(X1D10:121) IC1.122(X1D11:122) IC3.4(VREF_AC1) IC3.7(VREF_AC0) IC3.10(NC) IC3.18(Q03+) IC3.19(Q03-) IC3.28(Q07+) IC3.29(Q07-) IC3.36(Q10+) IC3.37(Q10-) IC3.38(Q11+) IC3.39(Q11-) IC6.6(XTO) IC12.6(XTO) IC13.2(NC) IC13.4(CLK_EN) IC13.6(CLK_N) J2.4 XTAG.1 XTAG.2 XTAG.3 XTAG.11 XTAG.17 XTAG.19 Y1.TRI Y2.TRI

## Library data of the parts
5V AG1 G1-G3 T0S1-T0S4 T1S1-T1S4 TP100 TP101 = pinhead:PINHD-1X1: PIN HEADER
C1-C20 C26 C28-C30 C32 C37 C39-C66 C68-C70 = SamacSys_Parts:885012205037: Wurth Elektronik 100nF Multilayer Ceramic Capacitor MLCC 16V dc +/-10% X7R Dielectric 0402 (1005M) SMD Source: Datasheet <https://katalog.we-online.com/pbs/datasheet/885012205037.pdf>; DESCRIPTION: Wurth Elektronik 100nF Multilayer Ceramic Capacitor MLCC 16V dc +/-10% X7R Dielectric 0402 (1005M) SMD; HEIGHT: 0.55mm; MANUFACTURER_NAME: Wurth Elektronik; MANUFACTURER_PART_NUMBER: 885012205037; MOUSER_PART_NUMBER: 710-885012205037; MOUSER_PRICE-STOCK: https://www.mouser.com/Search/Refine.aspx?Keyword=710-885012205037; RS_PART_NUMBER: 8391528P; RS_PRICE-STOCK: http://uk.rs-online.com/web/p/products/8391528P
C21-C25 = EMK105BJ105KV-F:EMK105BJ105KV-F: TAIYO YUDEN - EMK105BJ105KV-F - SMD Multilayer Ceramic Capacitor, 1 F, 16 V, 0402 [1005 Metric], +/- 10%, X5R, M Series Source: Datasheet <https://ms.componentsearchengine.com/Datasheets/2/EMK105BJ105KV-F.pdf>; DESCRIPTION: TAIYO YUDEN - EMK105BJ105KV-F - SMD Multilayer Ceramic Capacitor, 1 F, 16 V, 0402 [1005 Metric], +/- 10%, X5R, M Series; HEIGHT: 0.55mm; MANUFACTURER_NAME: TAIYO YUDEN; MANUFACTURER_PART_NUMBER: EMK105BJ105KV-F
C27 = 0402N131J500CT:0402N131J500CT: Multilayer Ceramic Capacitors MLCC - SMD/SMT 130pF +-5% 50V Source: Datasheet <https://www.mouser.de/datasheet/2/210/WTC_MLCC_General_Purpose-1534899.pdf>; DESCRIPTION: Multilayer Ceramic Capacitors MLCC - SMD/SMT 130pF +-5% 50V; HEIGHT: 0.55mm; MANUFACTURER_NAME: Walsin Technology Corporation; MANUFACTURER_PART_NUMBER: 0402N131J500CT
C33 C35 = SamacSys_Parts:GRM155R61A475MEAAD: Multilayer Ceramic Capacitors MLCC - SMD/SMT 4.7UF 10V 20% 0402 Source: Datasheet <https://psearch.en.murata.com/capacitor/product/GRM155R61A475MEAA#.html>; DESCRIPTION: Multilayer Ceramic Capacitors MLCC - SMD/SMT 4.7UF 10V 20% 0402; HEIGHT: 0.55mm; MANUFACTURER_NAME: Murata Electronics; MANUFACTURER_PART_NUMBER: GRM155R61A475MEAAD; MOUSER_PART_NUMBER: 81-GRM155R61A475MEAD; MOUSER_PRICE-STOCK: https://www.mouser.com/Search/Refine.aspx?Keyword=81-GRM155R61A475MEAD; RS_PART_NUMBER: 1726870P; RS_PRICE-STOCK: http://uk.rs-online.com/web/p/products/1726870P
C34 C36 = SamacSys_Parts:GRM21BR61A226ME51L: MURATA - GRM21BR61A226ME51L - CAP, MLCC, X5R, 22UF, 10V, 0805 Source: Datasheet <http://www.murata.com/~/media/webrenewal/support/library/catalog/products/capacitor/mlcc/c02e.pdf>; DESCRIPTION: MURATA - GRM21BR61A226ME51L - CAP, MLCC, X5R, 22UF, 10V, 0805; HEIGHT: 1.45mm; MANUFACTURER_NAME: Murata Electronics; MANUFACTURER_PART_NUMBER: GRM21BR61A226ME51L; MOUSER_PART_NUMBER: 81-GRM21BR61A226ME1L; MOUSER_PRICE-STOCK: https://www.mouser.com/Search/Refine.aspx?Keyword=81-GRM21BR61A226ME1L; RS_PART_NUMBER: 1138704P; RS_PRICE-STOCK: http://uk.rs-online.com/web/p/products/1138704P
C38 = SamacSys_Parts:C0402C272K5RACTU: Kemet 0402 C 2.7nF Ceramic Multilayer Capacitor, 50 V, +125C, X7R Dielectric, +/-10% Source: Datasheet <https://content.kemet.com/datasheets/KEM_C1002_X7R_SMD.pdf>; ARROW_PART_NUMBER: C0402C272K5RACTU; ARROW_PRICE-STOCK: https://www.arrow.com/en/products/c0402c272k5ractu/kemet-corporation; DESCRIPTION: Kemet 0402 C 2.7nF Ceramic Multilayer Capacitor, 50 V, +125C, X7R Dielectric, +/-10%; HEIGHT: 0.55mm; MANUFACTURER_NAME: Kemet; MANUFACTURER_PART_NUMBER: C0402C272K5RACTU; MOUSER_PART_NUMBER: 80-C0402C272K5R; MOUSER_PRICE-STOCK: https://www.mouser.co.uk/ProductDetail/KEMET/C0402C272K5RACTU?qs=TxK4V3E9jVrYhp3VnqFMMw%3D%3D
C71 = SamacSys_Parts:GRM188R71A225KE15D: Ceramic SMT capacitor 2.2uF 10Vdc Murata 0603 GRM 2.2??F Ceramic Multilayer Capacitor, 10 V dc, +125??C, X7R Dielectric, ??10% Source: Datasheet <https://psearch.en.murata.com/capacitor/product/GRM188R71A225KE15#.html>; DESCRIPTION: Ceramic SMT capacitor 2.2uF 10Vdc Murata 0603 GRM 2.2??F Ceramic Multilayer Capacitor, 10 V dc, +125??C, X7R Dielectric, ??10%; HEIGHT: 0.9mm; MANUFACTURER_NAME: Murata Electronics; MANUFACTURER_PART_NUMBER: GRM188R71A225KE15D; MOUSER_PART_NUMBER: 81-GRM188R71A225KE15; MOUSER_PRICE-STOCK: https://www.mouser.com/Search/Refine.aspx?Keyword=81-GRM188R71A225KE15; RS_PART_NUMBER: 7235597P; RS_PRICE-STOCK: http://uk.rs-online.com/web/p/products/7235597P
FB1 = SamacSys_Parts:BLM18PG121SN1D: Ferrite bead SMD 0603 120R 2A Murata Ferrite Bead (Chip Ferrite Bead), 1.6 x 0.8 x 0.8mm (0603), 120 impedance at 100 MHz Source: Datasheet <https://www.murata.com/en-us/products/productdetail?partno=BLM18PG121SN1#>; DESCRIPTION: Ferrite bead SMD 0603 120R 2A Murata Ferrite Bead (Chip Ferrite Bead), 1.6 x 0.8 x 0.8mm (0603), 120 impedance at 100 MHz; HEIGHT: 0.95mm; MANUFACTURER_NAME: Murata Electronics; MANUFACTURER_PART_NUMBER: BLM18PG121SN1D; MOUSER_PART_NUMBER: 81-BLM18PG121SN1D; MOUSER_PRICE-STOCK: https://www.mouser.com/Search/Refine.aspx?Keyword=81-BLM18PG121SN1D; RS_PART_NUMBER: 7241380P; RS_PRICE-STOCK: http://uk.rs-online.com/web/p/products/7241380P
IC1 = XUF216-512-TQ128-C20:XUF216-512-TQ128-C20: IC MCU 32BIT 2MB FLASH 128TQFP Source: Datasheet <http://www.xmos.com/published/xuf216-512-tq128-datasheet?version=latest>; DESCRIPTION: IC MCU 32BIT 2MB FLASH 128TQFP; HEIGHT: 1.2mm; MANUFACTURER_NAME: XMOS; MANUFACTURER_PART_NUMBER: XUF216-512-TQ128-C20
IC2 = SamacSys_Parts:TPD2E001DRLRG4: ESD Suppressors / TVS Diodes Low-Cap 2Ch ESD Protection Array Source: Datasheet <http://www.ti.com/general/docs/suppproductinfo.tsp?distId=10&gotoUrl=http://www.ti.com/lit/gpn/tpd2e001>; DESCRIPTION: ESD Suppressors / TVS Diodes Low-Cap 2Ch ESD Protection Array; HEIGHT: 0.6mm; MANUFACTURER_NAME: Texas Instruments; MANUFACTURER_PART_NUMBER: TPD2E001DRLRG4; MOUSER_PART_NUMBER: 595-TPD2E001DRLRG4; MOUSER_PRICE-STOCK: https://www.mouser.com/Search/Refine.aspx?Keyword=595-TPD2E001DRLRG4
IC3 = PI6C5921512ZDIEX:PI6C5921512ZDIEX: IC CLOCK BUFFER W-QFN6060-40 Source: Datasheet <https://www.diodes.com/assets/Datasheets/PI6C5921512.pdf>; DESCRIPTION: IC CLOCK BUFFER W-QFN6060-40; HEIGHT: 0.8mm; MANUFACTURER_NAME: Diodes Inc.; MANUFACTURER_PART_NUMBER: PI6C5921512ZDIEX
IC4 = SamacSys_Parts:74AHC1G79GW,125: 74AHC(T)1G79 - Single D-type flip-flop; positive-edge trigger@en-us Source: Datasheet <https://assets.nexperia.com/documents/data-sheet/74AHC_AHCT1G79.pdf>; DESCRIPTION: 74AHC(T)1G79 - Single D-type flip-flop; positive-edge trigger@en-us; HEIGHT: 1.1mm; MANUFACTURER_NAME: Nexperia; MANUFACTURER_PART_NUMBER: 74AHC1G79GW,125; MOUSER_PART_NUMBER: 771-74AHC1G79GW-G; MOUSER_PRICE-STOCK: https://www.mouser.com/Search/Refine.aspx?Keyword=771-74AHC1G79GW-G; RS_PART_NUMBER: 8139226P; RS_PRICE-STOCK: http://uk.rs-online.com/web/p/products/8139226P
IC5 = SamacSys_Parts:SN74LVC2G34DBVR: Texas Instruments SN74LVC2G34DBVR, Dual, Buffer, Non-Inverting, 1.65 5.5 V, 6-Pin SOT-23 Source: Datasheet <https://www.ti.com/lit/gpn/SN74LVC2G34>; DESCRIPTION: Texas Instruments SN74LVC2G34DBVR, Dual, Buffer, Non-Inverting, 1.65 5.5 V, 6-Pin SOT-23; HEIGHT: 1.45mm; MANUFACTURER_NAME: Texas Instruments; MANUFACTURER_PART_NUMBER: SN74LVC2G34DBVR; MOUSER_PART_NUMBER: 595-SN74LVC2G34DBVR; MOUSER_PRICE-STOCK: https://www.mouser.com/Search/Refine.aspx?Keyword=595-SN74LVC2G34DBVR; RS_PART_NUMBER: 1627497; RS_PRICE-STOCK: http://uk.rs-online.com/web/p/products/1627497
IC6 IC12 = CS2100CP-CZZ:CS2100CP-CZZ: Clock Synthesizer / Jitter Cleaner IC Gen Purpose PLL Clock Multi 8-75MHz Source: Datasheet <https://ms.componentsearchengine.com/Datasheets/34/CS2100CP-CZZ.pdf>; DESCRIPTION: Clock Synthesizer / Jitter Cleaner IC Gen Purpose PLL Clock Multi 8-75MHz; HEIGHT: 1.1mm; MANUFACTURER_NAME: Cirrus Logic; MANUFACTURER_PART_NUMBER: CS2100CP-CZZ
IC8 = SamacSys_Parts:STM1061N28WX6F: STM1061N28WX6F, Voltage Detector 2.744V Low Power Voltage Detector 3-Pin SOT-23 Source: Datasheet <http://docs-emea.rs-online.com/webdocs/0db0/0900766b80db0f10.pdf>; ALLIED_NUMBER: 70390897; ALLIED_PRICE-STOCK: http://www.alliedelec.com/stmicroelectronics-stm1061n28wx6f/70390897/; DESCRIPTION: STM1061N28WX6F, Voltage Detector 2.744V Low Power Voltage Detector 3-Pin SOT-23; HEIGHT: 1.12mm; MANUFACTURER_NAME: STMicroelectronics; MANUFACTURER_PART_NUMBER: STM1061N28WX6F; MOUSER_PART_NUMBER: 511-STM1061N28WX6F; MOUSER_PRICE-STOCK: https://www.mouser.com/Search/Refine.aspx?Keyword=511-STM1061N28WX6F; RS_PART_NUMBER: 6864796; RS_PRICE-STOCK: https://uk.rs-online.com/web/p/products/6864796
IC9 = MAX6895AALT+T:MAX6895AALT+T: MAXIM INTEGRATED PRODUCTS - MAX6895AALT+T - MPU Supervisor, 1.5V-5.5V supply, Active-High, Push-Pull reset, 500 mV threshold, UDFN-6 Source: Datasheet <https://ms.componentsearchengine.com/Datasheets/2/MAX6895AALT T.pdf>; DESCRIPTION: MAXIM INTEGRATED PRODUCTS - MAX6895AALT+T - MPU Supervisor, 1.5V-5.5V supply, Active-High, Push-Pull reset, 500 mV threshold, UDFN-6; HEIGHT: 0.75mm; MANUFACTURER_NAME: Maxim Integrated; MANUFACTURER_PART_NUMBER: MAX6895AALT+T
IC10 = SamacSys_Parts:74LVC1G11GW,125: 74LVC1G11 - Single 3-input AND gate@en-us Source: Datasheet <https://assets.nexperia.com/documents/data-sheet/74LVC1G11.pdf>; ARROW_PART_NUMBER: 74LVC1G11GW,125; ARROW_PRICE-STOCK: https://www.arrow.com/en/products/74lvc1g11gw125/nexperia; DESCRIPTION: 74LVC1G11 - Single 3-input AND gate@en-us; HEIGHT: 1.1mm; MANUFACTURER_NAME: Nexperia; MANUFACTURER_PART_NUMBER: 74LVC1G11GW,125; MOUSER_PART_NUMBER: 771-LVC1G11GW125; MOUSER_PRICE-STOCK: https://www.mouser.co.uk/ProductDetail/Nexperia/74LVC1G11GW125?qs=me8TqzrmIYXwElq8SLtsVg%3D%3D
IC11 = SamacSys_Parts:SN65LVDT386DGG: Texas Instruments SN65LVDT386DGG, LVDS Receiver, 3 3.6 V, 64-Pin, TSSOP Source: Datasheet <http://www.ti.com/lit/gpn/SN65LVDT386>; ARROW_PART_NUMBER: SN65LVDT386DGG; ARROW_PRICE-STOCK: https://www.arrow.com/en/products/sn65lvdt386dgg/texas-instruments; DESCRIPTION: Texas Instruments SN65LVDT386DGG, LVDS Receiver, 3 3.6 V, 64-Pin, TSSOP; HEIGHT: 1.2mm; MANUFACTURER_NAME: Texas Instruments; MANUFACTURER_PART_NUMBER: SN65LVDT386DGG; MOUSER_PART_NUMBER: 595-SN65LVDT386DGG; MOUSER_PRICE-STOCK: https://www.mouser.co.uk/ProductDetail/Texas-Instruments/SN65LVDT386DGG?qs=X1HXWTtiZ0S2Bmbe3UNvXA%3D%3D
IC13 = SamacSys_Parts:LMK00804BQWRGTTQ1: 1.5-V to 3.3-V, 1-to-4 high-performance LVCMOS fan-out buffer and level translator Source: Datasheet <http://www.ti.com/general/docs/suppproductinfo.tsp?distId=10&gotoUrl=http://www.ti.com/lit/gpn/lmk00804b-q1>; ARROW_PART_NUMBER: LMK00804BQWRGTTQ1; ARROW_PRICE-STOCK: https://www.arrow.com/en/products/lmk00804bqwrgttq1/texas-instruments; DESCRIPTION: 1.5-V to 3.3-V, 1-to-4 high-performance LVCMOS fan-out buffer and level translator; HEIGHT: 1mm; MANUFACTURER_NAME: Texas Instruments; MANUFACTURER_PART_NUMBER: LMK00804BQWRGTTQ1; MOUSER_PART_NUMBER: 595-MK00804BQWRGTTQ1; MOUSER_PRICE-STOCK: https://www.mouser.co.uk/ProductDetail/Texas-Instruments/LMK00804BQWRGTTQ1?qs=%252B6g0mu59x7Kh8c2n9hD2hQ%3D%3D
J1 = SamacSys_Parts:RJHSE-5081-08: Modular Connectors / Ethernet Connectors CAT 5 MODULAR JACK HIGH TEMP Source: Datasheet <https://componentsearchengine.com/Datasheets/2/RJHSE-5081-08.pdf>; ARROW_PART_NUMBER: RJHSE-5081-08; DESCRIPTION: Modular Connectors / Ethernet Connectors CAT 5 MODULAR JACK HIGH TEMP; HEIGHT: 13.21mm; MANUFACTURER_NAME: Amphenol; MANUFACTURER_PART_NUMBER: RJHSE-5081-08; MOUSER_PART_NUMBER: 523-RJHSE-5081-08; MOUSER_PRICE-STOCK: https://www.mouser.co.uk/ProductDetail/Amphenol-Commercial-Products/RJHSE-5081-08?qs=St27ATL478t2mt14j5qgVg%3D%3D
J2 = SamacSys_Parts:10118193-0001LF: USB Connectors 5P MICRO USB TYPE B RECEPTACLE W/ PEGS Source: Datasheet <https://componentsearchengine.com/Datasheets/1/10118193-0001LF.pdf>; ALLIED_NUMBER: 70236827; ALLIED_PRICE-STOCK: https://www.alliedelec.com/amphenolicc-10118193-0001lf/70236827/; DESCRIPTION: USB Connectors 5P MICRO USB TYPE B RECEPTACLE W/ PEGS; HEIGHT: 3.1mm; MANUFACTURER_NAME: Amphenol; MANUFACTURER_PART_NUMBER: 10118193-0001LF; MOUSER_PART_NUMBER: 649-10118193-0001LF; MOUSER_PRICE-STOCK: https://www.mouser.com/Search/Refine.aspx?Keyword=649-10118193-0001LF; RS_PART_NUMBER: 8632989; RS_PRICE-STOCK: http://uk.rs-online.com/web/p/products/8632989
J3 J4 = SamacSys_Parts:1-1634622-0: BNC black r/a insul PCB socket ,75 ohm Source: Datasheet <https://componentsearchengine.com/Datasheets/2/1-1634622-0.pdf>; ALLIED_NUMBER: 70084611; ALLIED_PRICE-STOCK: https://www.alliedelec.com/teconnectivity-1-1634622-0/70084611/; DESCRIPTION: BNC black r/a insul PCB socket ,75 ohm; HEIGHT: 34.9mm; MANUFACTURER_NAME: TE Connectivity; MANUFACTURER_PART_NUMBER: 1-1634622-0; MOUSER_PART_NUMBER: 571-1-1634622-0; MOUSER_PRICE-STOCK: https://www.mouser.com/Search/Refine.aspx?Keyword=571-1-1634622-0; RS_PART_NUMBER: 5121310; RS_PRICE-STOCK: http://uk.rs-online.com/web/p/products/5121310
J5 = SamacSys_Parts:PJ-079BH: DC Power Connectors power jack, 2.5 x 5.8 mm, horizontal, through hole, high current, w/ shielding,1 switch Source: Datasheet <http://www.mouser.com/datasheet/2/670/pj-079bh-1517209.pdf>; DESCRIPTION: DC Power Connectors power jack, 2.5 x 5.8 mm, horizontal, through hole, high current, w/ shielding,1 switch; HEIGHT: 7.3mm; MANUFACTURER_NAME: CUI Devices; MANUFACTURER_PART_NUMBER: PJ-079BH; MOUSER_PART_NUMBER: 490-PJ-079BH; MOUSER_PRICE-STOCK: https://www.mouser.com/Search/Refine.aspx?Keyword=490-PJ-079BH
JP1 = pinhead:PINHD-1X2: PIN HEADER
L1 L2 = SamacSys_Parts:NRH2412T2R2MNGH: TAIYO YUDEN - NRH2412T2R2MNGH - INDUCTOR, WIREWOUND, 2.2UH, 1A Source: Datasheet <http://ds.yuden.co.jp/TYCOMPAS/ut/detail.do?productNo=NRH2412T2R2MNGH&fileName=NRH2412T2R2MNGH_SS&mode=specSheetDownload>; DESCRIPTION: TAIYO YUDEN - NRH2412T2R2MNGH - INDUCTOR, WIREWOUND, 2.2UH, 1A; HEIGHT: 1mm; MANUFACTURER_NAME: TAIYO YUDEN; MANUFACTURER_PART_NUMBER: NRH2412T2R2MNGH; MOUSER_PART_NUMBER: 963-NRH2412T2R2MNGH; MOUSER_PRICE-STOCK: https://www.mouser.com/Search/Refine.aspx?Keyword=963-NRH2412T2R2MNGH
ON = SamacSys_Parts:150060VS75000: LED,Wurth Elektronik,150060VS75000 Wurth Elektronik 150060VS75000, WL-SMCW Series Green LED, 570 nm, 1608 (0603) Clear, Rectangle Lens SMD Package Source: Datasheet <http://docs-emea.rs-online.com/webdocs/1302/0900766b81302e1e.pdf>; DESCRIPTION: LED,Wurth Elektronik,150060VS75000 Wurth Elektronik 150060VS75000, WL-SMCW Series Green LED, 570 nm, 1608 (0603) Clear, Rectangle Lens SMD Package; HEIGHT: 0.8mm; MANUFACTURER_NAME: Wurth Elektronik; MANUFACTURER_PART_NUMBER: 150060VS75000; MOUSER_PART_NUMBER: 710-150060VS75000; MOUSER_PRICE-STOCK: https://www.mouser.com/Search/Refine.aspx?Keyword=710-150060VS75000; RS_PART_NUMBER: 8154215P; RS_PRICE-STOCK: http://uk.rs-online.com/web/p/products/8154215P
Q1 = SamacSys_Parts:BSS138PW,115: BSS138PW,115 N-Channel MOSFET, 320 mA, 60 V, 3-Pin SOT-323 Nexperia Source: Datasheet <https://assets.nexperia.com/documents/data-sheet/BSS138PW.pdf>; DESCRIPTION: BSS138PW,115 N-Channel MOSFET, 320 mA, 60 V, 3-Pin SOT-323 Nexperia; HEIGHT: 1.1mm; MANUFACTURER_NAME: Nexperia; MANUFACTURER_PART_NUMBER: BSS138PW,115; MOUSER_PART_NUMBER: 771-BSS138PW115; MOUSER_PRICE-STOCK: https://www.mouser.com/Search/Refine.aspx?Keyword=771-BSS138PW115; RS_PART_NUMBER: 7920904P; RS_PRICE-STOCK: http://uk.rs-online.com/web/p/products/7920904P
R1 = SamacSys_Parts:RC0402FR-074R7L: RESISTOR, 0402 4.7 Ohms +/-1% 1/16 W Source: Datasheet <http://www.yageo.com/documents/recent/PYu-RC0402_51_RoHS_L_6_r.pdf>; DESCRIPTION: RESISTOR, 0402 4.7 Ohms +/-1% 1/16 W; HEIGHT: 0.4mm; MANUFACTURER_NAME: YAGEO (PHYCOMP); MANUFACTURER_PART_NUMBER: RC0402FR-074R7L; MOUSER_PART_NUMBER: 603-RC0402FR-074R7L; MOUSER_PRICE-STOCK: https://www.mouser.com/Search/Refine.aspx?Keyword=603-RC0402FR-074R7L
R2 = SamacSys_Parts:RC1206JR-7W0RL: Thick Film Resistors - SMD Source: Datasheet <https://www.sos.sk/productdata/35/10/4/35104/RC1206.pdf>; ARROW_PART_NUMBER: RC1206JR-7W0RL; ARROW_PRICE-STOCK: https://www.arrow.com/en/products/rc1206jr-7w0rl/yageo; DESCRIPTION: Thick Film Resistors - SMD; HEIGHT: 0.65mm; MANUFACTURER_NAME: YAGEO (PHYCOMP); MANUFACTURER_PART_NUMBER: RC1206JR-7W0RL; MOUSER_PART_NUMBER: 603-RC1206JR-7W0RL; MOUSER_PRICE-STOCK: https://www.mouser.co.uk/ProductDetail/Yageo/RC1206JR-7W0RL?qs=SpcVWRniGQWX0kFN3RhSdg%3D%3D
R3 R38 = ERA-2AKD330X:ERA-2AKD330X: Thin Film Resistors - SMD 0402 33ohm .5% AEC-Q200 Source: Datasheet; DESCRIPTION: Thin Film Resistors - SMD 0402 33ohm .5% AEC-Q200; HEIGHT: 0.4mm; MANUFACTURER_NAME: Panasonic; MANUFACTURER_PART_NUMBER: ERA-2AKD330X
R4 = SamacSys_Parts:CRCW040243R2FKED: RESISTOR, 0402 43.2 Ohms +/-1% 0.063W Source: Datasheet <http://www.vishay.com/docs/20035/dcrcwe3.pdf>; ALLIED_NUMBER: 70202146; ALLIED_PRICE-STOCK: https://www.alliedelec.com/vishay-dale-crcw040243r2fked/70202146/; DESCRIPTION: RESISTOR, 0402 43.2 Ohms +/-1% 0.063W; HEIGHT: 0.4mm; MANUFACTURER_NAME: Vishay; MANUFACTURER_PART_NUMBER: CRCW040243R2FKED; RS_PART_NUMBER: 8322825; RS_PRICE-STOCK: https://uk.rs-online.com/web/p/products/8322825
R5-R7 R41-R46 = SamacSys_Parts:ERJ-2RKF1001X: Thick Film Resistors - SMD 0402 1Kohms 1% AEC-Q200 Source: Datasheet <https://industrial.panasonic.com/cdbs/www-data/pdf/RDA0000/AOA0000C86.pdf>; ALLIED_NUMBER: 70265092; ALLIED_PRICE-STOCK: https://www.alliedelec.com/panasonic-erj-2rkf1001x/70265092/; DESCRIPTION: Thick Film Resistors - SMD 0402 1Kohms 1% AEC-Q200; HEIGHT: 0.4mm; MANUFACTURER_NAME: Panasonic; MANUFACTURER_PART_NUMBER: ERJ-2RKF1001X; MOUSER_PART_NUMBER: 667-ERJ-2RKF1001X; MOUSER_PRICE-STOCK: https://www.mouser.com/Search/Refine.aspx?Keyword=667-ERJ-2RKF1001X
R8 R11 = SamacSys_Parts:ESR10EZPJ183: Thick Film Resistors - SMD 0805 18Kohm 5% Anti Surge AEC-Q200 Source: Datasheet <https://www.mouser.de/datasheet/2/348/esr-e-1139161.pdf>; DESCRIPTION: Thick Film Resistors - SMD 0805 18Kohm 5% Anti Surge AEC-Q200; HEIGHT: 0.65mm; MANUFACTURER_NAME: ROHM Semiconductor; MANUFACTURER_PART_NUMBER: ESR10EZPJ183
R9 = SamacSys_Parts:ERJP06J562V: Panasonic ERJP06 value Source: Datasheet <http://industrial.panasonic.com/cdbs/www-data/pdf/RDA0000/AOA0000C102.pdf>; DESCRIPTION: Panasonic ERJP06 value; HEIGHT: 0.7mm; MANUFACTURER_NAME: Panasonic; MANUFACTURER_PART_NUMBER: ERJP06J562V
R10 = SamacSys_Parts:CRGH0805F2K2: Thick Film Resistors - SMD CRGH0805 1% 2K2 0.33W Source: Datasheet <http://docs-europe.electrocomponents.com/webdocs/12d7/0900766b812d7379.pdf>; DESCRIPTION: Thick Film Resistors - SMD CRGH0805 1% 2K2 0.33W; HEIGHT: 0.65mm; MANUFACTURER_NAME: TE Connectivity; MANUFACTURER_PART_NUMBER: CRGH0805F2K2; MOUSER_PART_NUMBER: 279-CRGH0805F2K2; MOUSER_PRICE-STOCK: https://www.mouser.com/Search/Refine.aspx?Keyword=279-CRGH0805F2K2
R12 = SamacSys_Parts:CRGH0805F4K7: TE CONNECTIVITY - CRGH0805F4K7 - RES, THICK FILM, 4K7, 1%, 0.33W, 0805 Source: Datasheet <http://docs-europe.electrocomponents.com/webdocs/12d7/0900766b812d7379.pdf>; DESCRIPTION: TE CONNECTIVITY - CRGH0805F4K7 - RES, THICK FILM, 4K7, 1%, 0.33W, 0805; HEIGHT: 0.65mm; MANUFACTURER_NAME: TE Connectivity; MANUFACTURER_PART_NUMBER: CRGH0805F4K7
R13 = SamacSys_Parts:AS08J1001ET: Ohmite AS08 Series Thick Film Anti Surge Fixed Resistor 1k +/-5% 0.33W +/-100ppm/C Source: Datasheet <https://www.mouser.it/datasheet/2/303/ohmite_res_as_smd-1189203.pdf>; DESCRIPTION: Ohmite AS08 Series Thick Film Anti Surge Fixed Resistor 1k +/-5% 0.33W +/-100ppm/C; HEIGHT: 0.65mm; MANUFACTURER_NAME: Ohmite; MANUFACTURER_PART_NUMBER: AS08J1001ET; MOUSER_PART_NUMBER: 588-AS08J1001ET; MOUSER_PRICE-STOCK: https://www.mouser.com/Search/Refine.aspx?Keyword=588-AS08J1001ET; RS_PART_NUMBER: 1364742P; RS_PRICE-STOCK: http://uk.rs-online.com/web/p/products/1364742P
R14 R15 R17 R19 R20 R37 R39 = SamacSys_Parts:ERJ2RKF1002X: Precision,Thick,Chip Resistors,Size1005 Panasonic Precision Thick Film Surface Mount Resistor 0402 Case 10k +/-1% 0.063W +/-100ppm/C Source: Datasheet <http://docs-europe.electrocomponents.com/webdocs/13ba/0900766b813ba21b.pdf>; ALLIED_NUMBER: 70265404; ALLIED_PRICE-STOCK: https://www.alliedelec.com/panasonic-erj-2rkf1002x/70265404/; DESCRIPTION: Precision,Thick,Chip Resistors,Size1005 Panasonic Precision Thick Film Surface Mount Resistor 0402 Case 10k +/-1% 0.063W +/-100ppm/C; HEIGHT: 0.4mm; MANUFACTURER_NAME: Panasonic; MANUFACTURER_PART_NUMBER: ERJ2RKF1002X; RS_PART_NUMBER: 7325246; RS_PRICE-STOCK: http://uk.rs-online.com/web/p/products/7325246
R16 = RC0100JR-073K9L:RC0100JR-073K9L: Thick Film Resistors - SMD Source: Datasheet <https://ms.componentsearchengine.com/Datasheets/1/RC0100JR-073K9L.pdf>; DESCRIPTION: Thick Film Resistors - SMD; HEIGHT: 0.15mm; MANUFACTURER_NAME: YAGEO (PHYCOMP); MANUFACTURER_PART_NUMBER: RC0100JR-073K9L
R18 = SamacSys_Parts:ERJ-2RKF1500X: RESISTOR, 0402 150 Ohm +/- 1 % 0.1 W Source: Datasheet <https://industrial.panasonic.com/cdbs/www-data/pdf/RDA0000/AOA0000C86.pdf>; ALLIED_NUMBER: 70265442; ALLIED_PRICE-STOCK: https://www.alliedelec.com/panasonic-erj-2rkf1500x/70265442/; DESCRIPTION: RESISTOR, 0402 150 Ohm +/- 1 % 0.1 W; HEIGHT: 0.4mm; MANUFACTURER_NAME: Panasonic; MANUFACTURER_PART_NUMBER: ERJ-2RKF1500X; MOUSER_PART_NUMBER: 667-ERJ-2RKF1500X; MOUSER_PRICE-STOCK: https://www.mouser.com/Search/Refine.aspx?Keyword=667-ERJ-2RKF1500X
R21-R24 = SamacSys_Parts:CRCW040243R0FKED: Vishay CRCW Series Thick Film Surface Mount Resistor 0402 Case 43 +/-1% 0.063W +/-100ppm/C Source: Datasheet <http://www.vishay.com/docs/20035/dcrcwe3.pdf>; ARROW_PART_NUMBER: CRCW040243R0FKED; DESCRIPTION: Vishay CRCW Series Thick Film Surface Mount Resistor 0402 Case 43 +/-1% 0.063W +/-100ppm/C; HEIGHT: 0.4mm; MANUFACTURER_NAME: Vishay; MANUFACTURER_PART_NUMBER: CRCW040243R0FKED; MOUSER_PART_NUMBER: 71-CRCW040243R0FKED; MOUSER_PRICE-STOCK: https://www.mouser.co.uk/ProductDetail/Vishay-Dale/CRCW040243R0FKED?qs=5Cg%252BUTAkO%252ByZXyDYTRIwiA%3D%3D
R25 = SamacSys_Parts:CR0402-FX-75R0GLF: Thick Film Resistors - SMD 75 OHM 1% Source: Datasheet <https://www.bourns.com/pdfs/CR0402.pdf>; ARROW_PART_NUMBER: CR0402-FX-75R0GLF; DESCRIPTION: Thick Film Resistors - SMD 75 OHM 1%; HEIGHT: 0.4mm; MANUFACTURER_NAME: Bourns; MANUFACTURER_PART_NUMBER: CR0402-FX-75R0GLF; MOUSER_PART_NUMBER: 652-CR0402FX-75R0GLF; MOUSER_PRICE-STOCK: https://www.mouser.co.uk/ProductDetail/Bourns/CR0402-FX-75R0GLF?qs=ePR1ZvdkOKJncn3BX0J37Q%3D%3D
R26 = RG1005P-60R4-D-T10:RG1005P-60R4-D-T10: Thin Film Resistors - SMD 1/16W 60.4 Ohms 0.5% 0402 25ppm Source: Datasheet <https://www.mouser.de/datasheet/2/392/n_catalog_partition01_en-1140338.pdf>; DESCRIPTION: Thin Film Resistors - SMD 1/16W 60.4 Ohms 0.5% 0402 25ppm; HEIGHT: 0.4mm; MANUFACTURER_NAME: Susumu; MANUFACTURER_PART_NUMBER: RG1005P-60R4-D-T10
R27 R28 = SamacSys_Parts:CRCW04020000Z0EDC: Thick Film Resistors - SMD 1/16watt 0ohm Commercial Use Source: Datasheet <https://www.vishay.com/docs/28773/crcwce3.pdf>; ARROW_PART_NUMBER: CRCW04020000Z0EDC; ARROW_PRICE-STOCK: https://www.arrow.com/en/products/crcw04020000z0edc/vishay; DESCRIPTION: Thick Film Resistors - SMD 1/16watt 0ohm Commercial Use; HEIGHT: 0.35mm; MANUFACTURER_NAME: Vishay; MANUFACTURER_PART_NUMBER: CRCW04020000Z0EDC; MOUSER_PART_NUMBER: 71-CRCW04020000Z0EDC; MOUSER_PRICE-STOCK: https://www.mouser.co.uk/ProductDetail/Vishay-Dale/CRCW04020000Z0EDC?qs=E3Y5ESvWgWOwcf2YlTW7ng%3D%3D
R40 = CRCW040247K0FKEDC:CRCW040247K0FKEDC: Thick Film Resistors - SMD 1/16watt 47Kohms 1% Commercial Use Source: Datasheet <https://ms.componentsearchengine.com/Datasheets/1/CRCW040247K0FKEDC.pdf>; DESCRIPTION: Thick Film Resistors - SMD 1/16watt 47Kohms 1% Commercial Use; HEIGHT: 0.35mm; MANUFACTURER_NAME: Vishay; MANUFACTURER_PART_NUMBER: CRCW040247K0FKEDC
RESET = SamacSys_Parts:LL3301AF065QJ: Pushbutton Switches 50mA 12VDC F065 5.0mm J-Lead Source: Datasheet <https://media.digikey.com/pdf/Data Sheets/E-Switch PDFs/LL3301AF065QJ.pdf>; DESCRIPTION: Pushbutton Switches 50mA 12VDC F065 5.0mm J-Lead; HEIGHT: 7.3mm; MANUFACTURER_NAME: E-Switch; MANUFACTURER_PART_NUMBER: LL3301AF065QJ; MOUSER_PART_NUMBER: 612-LL3301AF065QJ; MOUSER_PRICE-STOCK: https://www.mouser.com/Search/Refine.aspx?Keyword=612-LL3301AF065QJ
S1 = SamacSys_Parts:100SP1T2B4M6QE: E-SWITCH - 100SP1T2B4M6QE - SWITCH, TOGGLE, SPDT, 5A, 120VAC, 28VDC Source: Datasheet <http://spec_sheets.e-switch.com/specs/T111069.pdf>; DESCRIPTION: E-SWITCH - 100SP1T2B4M6QE - SWITCH, TOGGLE, SPDT, 5A, 120VAC, 28VDC; HEIGHT: 6.86mm; MANUFACTURER_NAME: E-Switch; MANUFACTURER_PART_NUMBER: 100SP1T2B4M6QE; MOUSER_PART_NUMBER: 612-100-A2461; MOUSER_PRICE-STOCK: https://www.mouser.com/Search/Refine.aspx?Keyword=612-100-A2461
TP01-TP09 TP10-TP50 TP65-TP74 TP76-TP79 TP81-TP83 = test_points:TESTPOINT_05_05
U1 U2 =  ST1S06APUR:ST1S06APUR
XTAG = SamacSys_Parts:30320-5002HB: Conn Shrouded Header HDR 20 POS 2.54mm Solder RA Thru-Hole Source: Datasheet <https://www.mouser.com/datasheet/2/1/TS0818-221281.pdf>; ALLIED_NUMBER: 70609809; ALLIED_PRICE-STOCK: https://www.alliedelec.com/3m-30320-5002hb/70609809/; DESCRIPTION: Conn Shrouded Header HDR 20 POS 2.54mm Solder RA Thru-Hole; HEIGHT: 8.78mm; MANUFACTURER_NAME: 3M; MANUFACTURER_PART_NUMBER: 30320-5002HB; MOUSER_PART_NUMBER: 517-30320-5002; MOUSER_PRICE-STOCK: https://www.mouser.com/Search/Refine.aspx?Keyword=517-30320-5002
Y1 = ASFL1:ASFL1-24.000MHZ-L-T: Oscillator 24MHz Source: Datasheet <https://ms.componentsearchengine.com/Datasheets/1/ASFL1-24.000MHZ-L-T.pdf>; DESCRIPTION: Oscillator 24MHz; HEIGHT: 1.3mm; MANUFACTURER_NAME: ABRACON; MANUFACTURER_PART_NUMBER: ASFL1-24.000MHZ-L-T; MOUSER_PART_NUMBER: 815-ASFL1-24-L-T; MOUSER_PRICE-STOCK: mouser.com/Search/Refine?Keyword=815-ASFL1-24-L-T
Y2 = ASFL1:ASFL1-24.576MHZ-EC-T: Standard Clock Oscillators 24.576MHz 50ppm -20C +70C Source: Datasheet <https://abracon.com/Oscillators/ASFL1.pdf>; DESCRIPTION: Oscillator 24.576MHz; HEIGHT: 1.3mm; MANUFACTURER_NAME: ABRACON; MANUFACTURER_PART_NUMBER: ASFL1-24.576MHZ-EC-T; MOUSER_PART_NUMBER: 815-ASFL1-24.5-EC-T; MOUSER_PRICE-STOCK: mouser.com/Search/Refine?Keyword=815-ASFL1-24.5-EC-T

## Net classes
1 diff_pair_top: width 0.305 mm, clearance 0.2 mm
2 diff_pair_bot: width 0.305 mm, clearance 0.2 mm